# Altium project LimeSDR-X3_1v0.PrjPcb (part 8 of 19)

## Sheet 16_LMS2_RF2_Misc.SchDoc: LMS2 RF2 Misc
size A3; Organization: Lime Microsystems; Address1: Surrey Tech Centre; Address2: Guildford GU2 7YG; Address3: Surrey; Address4: United Kingdom; Revision: v1.0; SheetNumber: 16; SheetTotal: 31
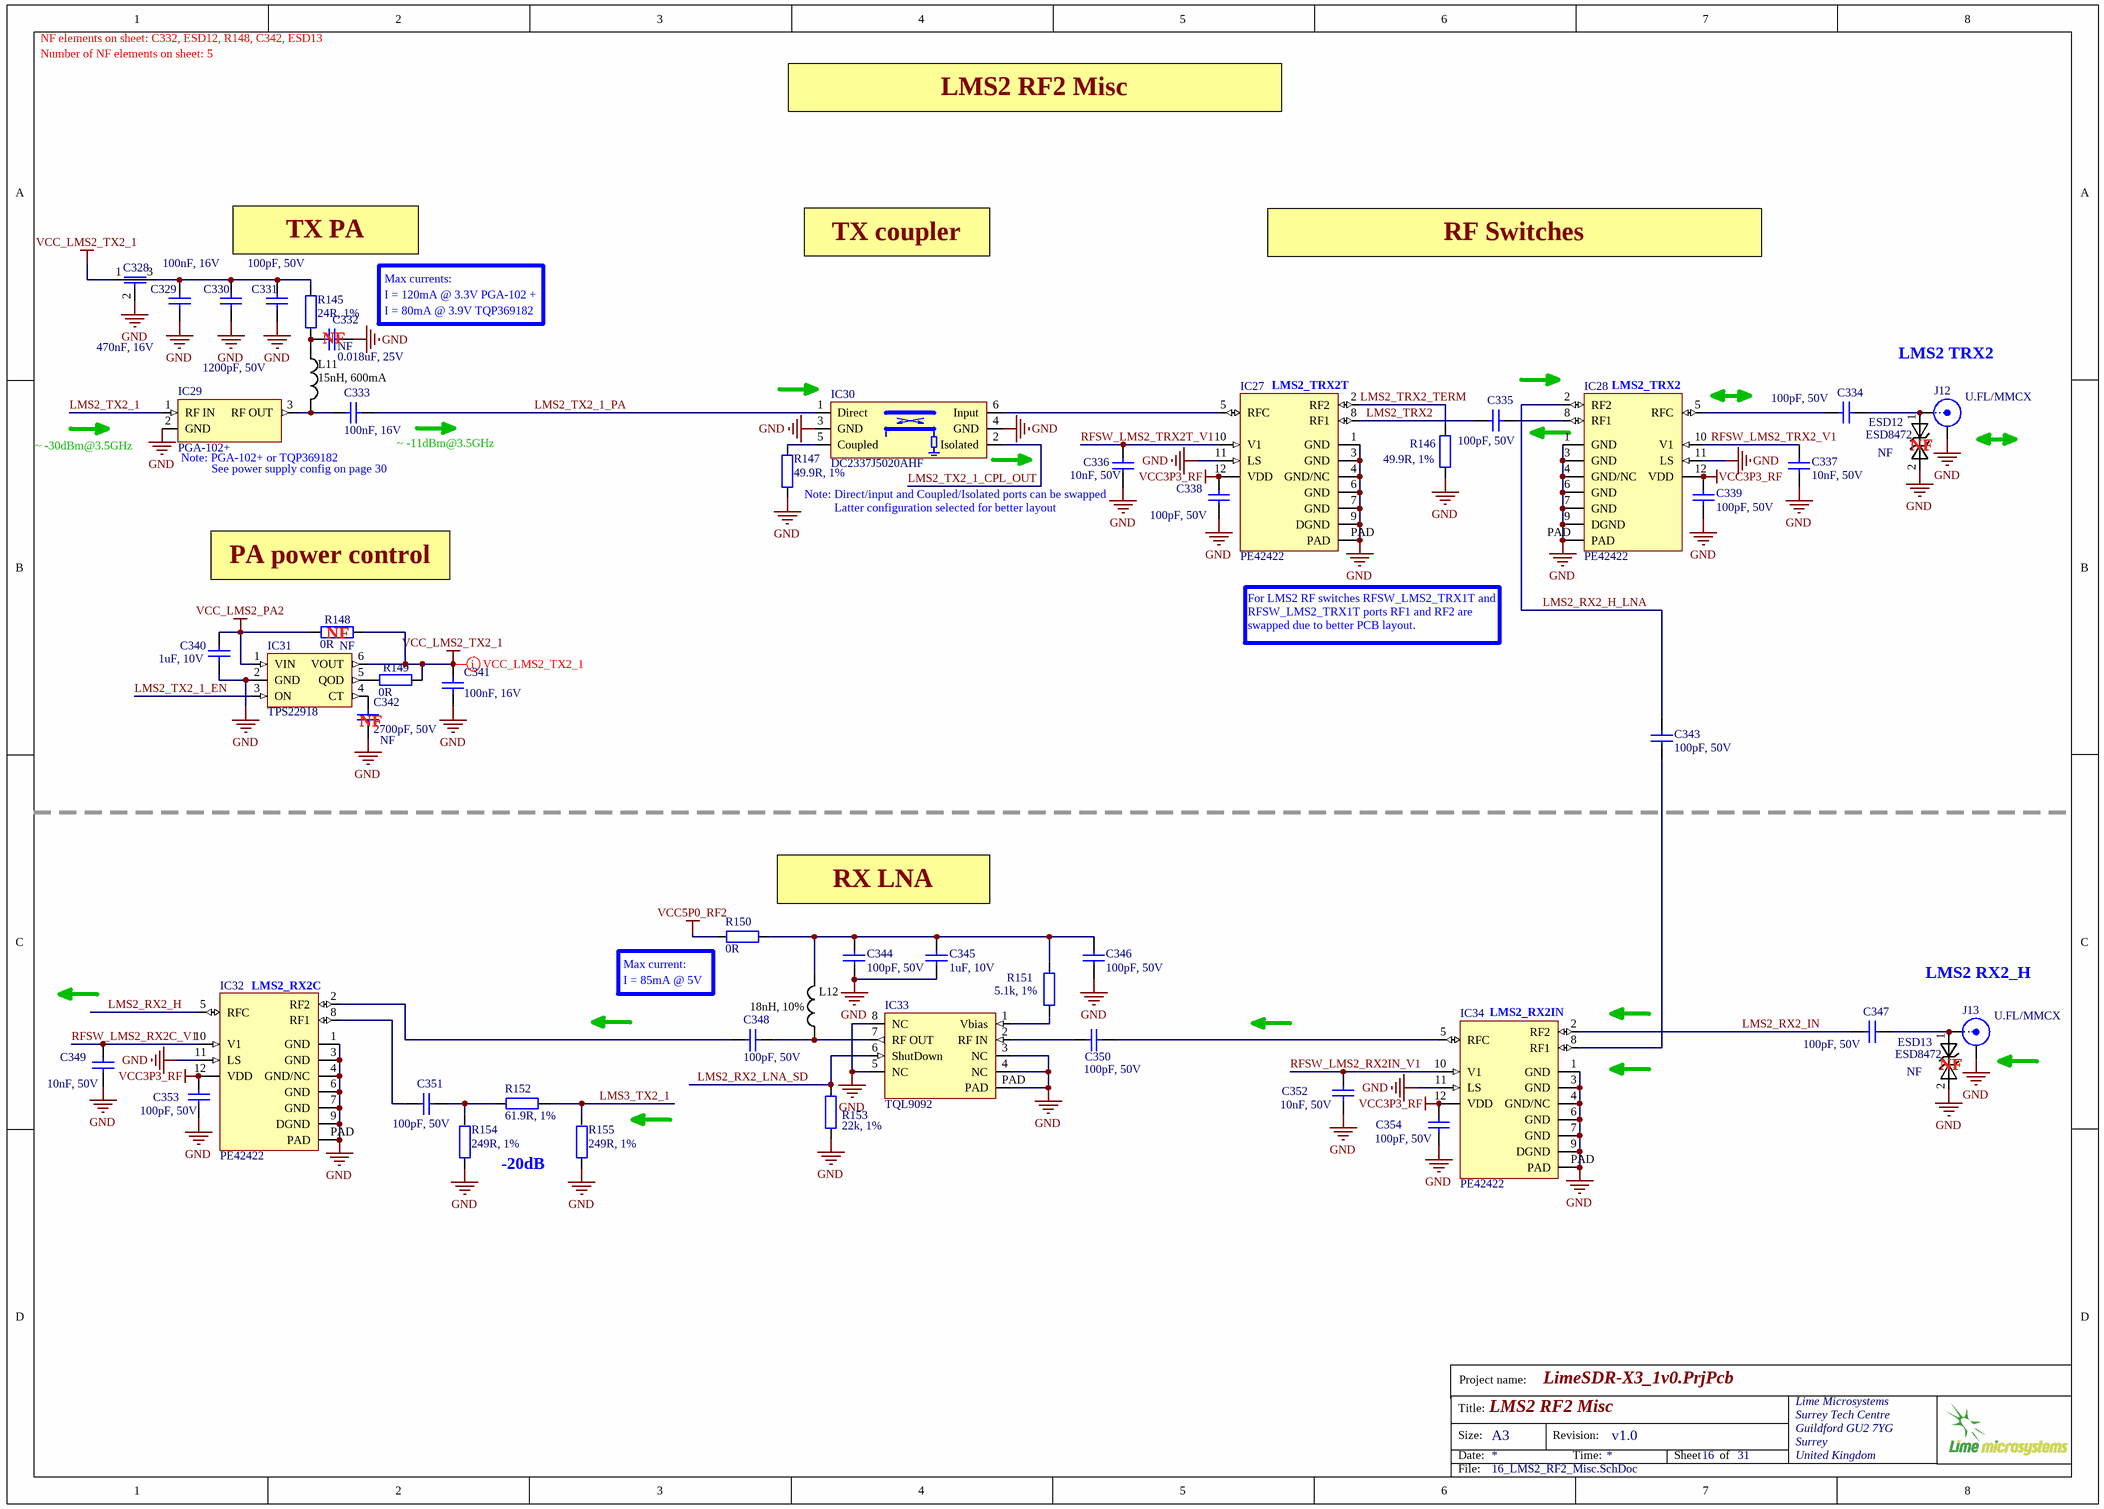
[diagram p15: 16_LMS2_RF2_Misc.SchDoc]

### Parts
C328  470nF, 16V  [CAP0805_FEEDTHROUGH]
C329  100nF, 16V  [CAP0402]
C330  1200pF, 50V  [CAP0402]
C331  100pF, 50V  [CAP0402]
C332  0.018uF, 25V  Assembly Info: NF  [CAP0402]
C333  100nF, 16V  [CAP0402]
C334  100pF, 50V  [CAP0402]
C335  100pF, 50V  [CAP0402]
C336  10nF, 50V  [CAP0402]
C337  10nF, 50V  [CAP0402]
C338  100pF, 50V  [CAP0402]
C339  100pF, 50V  [CAP0402]
C340  1uF, 10V  [CAP0402]
C341  100nF, 16V  [CAP0402]
C342  2700pF, 50V  Assembly Info: NF  [CAP0402]
C343  100pF, 50V  [CAP0402]
C344  100pF, 50V  [CAP0402]
C345  1uF, 10V  [CAP0402]
C346  100pF, 50V  [CAP0402]
C347  100pF, 50V  [CAP0402]
C348  100pF, 50V  [CAP0402]
C349  10nF, 50V  [CAP0402]
C350  100pF, 50V  [CAP0402]
C351  100pF, 50V  [CAP0402]
C352  10nF, 50V  [CAP0402]
C353  100pF, 50V  [CAP0402]
C354  100pF, 50V  [CAP0402]
ESD12  ESD8472  Assembly Info: NF  [ESD8472_X3DFN2]
ESD13  ESD8472  Assembly Info: NF  [ESD8472_X3DFN2]
IC27  PE42422  [PE42422_QFN12]
IC28  PE42422  [PE42422_QFN12]
IC29  PGA-102+  [PGA-102+_SOT89]
IC30  DC2337J5020AHF  [DC2337J5020AHF_ANAREN_COUPLER_0805]
IC31  TPS22918  [SOT23-6]
IC32  PE42422  [PE42422_QFN12]
IC33  TQL9092  [TQL9092]
IC34  PE42422  [PE42422_QFN12]
J12  U.FL/MMCX  [MMCX_UFL_conn_m]
J13  U.FL/MMCX  [MMCX_UFL_conn_m]
L11  15nH, 600mA  [RES0805]
L12  18nH, 10%  [RES0603]
R145  24R, 1%  [RES0402]
R146  49.9R, 1%  [RES0402]
R147  49.9R, 1%  [RES0402]
R148  0R  Assembly Info: NF  [RES0402]
R149  0R  [RES0402]
R150  0R  [RES0402]
R151  5.1k, 1%  [RES0603]
R152  61.9R, 1%  [RES0402]
R153  22k, 1%  [RES0402]
R154  249R, 1%  [RES0402]
R155  249R, 1%  [RES0402]

### Nets
GND: C328.2 C329.1 C330.2 C331.2 C332.2 C336.2 C337.2 C338.1 C339.1 C340.1 C341.1 C342.2 C344.2 C345.1 C346.2 C349.2 C352.2 C353.1 C354.1 ESD12.2 ESD13.2 IC27.1(GND) IC27.3(GND) IC27.4(GND/NC) IC27.6(GND) IC27.7(GND) IC27.9(DGND) IC27.11(LS) IC27.PAD IC28.1(GND) IC28.3(GND) IC28.4(GND/NC) IC28.6(GND) IC28.7(GND) IC28.9(DGND) IC28.11(LS) IC28.PAD IC29.2(GND) IC30.3(GND) IC30.4(GND) IC31.2(GND) IC32.1(GND) IC32.3(GND) IC32.4(GND/NC) IC32.6(GND) IC32.7(GND) IC32.9(DGND) IC32.11(LS) IC32.PAD IC33.3(NC) IC33.4(NC) IC33.5(NC) IC33.8(NC) IC33.PAD IC34.1(GND) IC34.3(GND) IC34.4(GND/NC) IC34.6(GND) IC34.7(GND) IC34.9(DGND) IC34.11(LS) IC34.PAD J12.2(Y) J13.2(Y) R146.2 R147.2 R153.1 R154.1 R155.1
VCC3P3_RF: C338.2 C339.2 C353.2 C354.2 IC27.12(VDD) IC28.12(VDD) IC32.12(VDD) IC34.12(VDD)
VCC5P0_RF2: R150.1
VCC_LMS2_PA2: C340.2 IC31.1(VIN) R148.2
VCC_LMS2_TX2_1: C328.1 C341.2 IC31.6(VOUT) R148.1 R149.1
LMS2_RX2_H: IC32.5(RFC)
LMS2_RX2_H_LNA: C343.2 IC28.2(RF2)
LMS2_RX2_IN: C347.1 IC34.2(RF2)
LMS2_RX2_LNA_SD: IC33.6(ShutDown) R153.2
LMS2_TRX2: C335.1 IC27.8(RF1)
LMS2_TRX2_TERM: IC27.2(RF2) R146.1
LMS2_TX2_1: IC29.1(RF_IN)
LMS2_TX2_1_CPL_OUT: IC30.2(Isolated)
LMS2_TX2_1_EN: IC31.3(ON)
LMS2_TX2_1_PA: C333.1 IC30.1(Direct)
LMS3_TX2_1: R152.2 R155.2
RFSW_LMS2_RX2C_V1: C349.1 IC32.10(V1)
RFSW_LMS2_RX2IN_V1: C352.1 IC34.10(V1)
RFSW_LMS2_TRX2_V1: C337.1 IC28.10(V1)
RFSW_LMS2_TRX2T_V1: C336.1 IC27.10(V1)
NetC328_3: C328.3 C329.2 C330.1 C331.1 R145.1
NetC332_1: C332.1 L11.1 R145.2
NetC333_2: C333.2 IC29.3(RF_OUT) L11.2
NetC334_1: C334.1 IC28.5(RFC)
NetC334_2: C334.2 ESD12.1 J12.1(X)
NetC335_2: C335.2 IC28.8(RF1)
NetC342_1: C342.1 IC31.4(CT)
NetC343_1: C343.1 IC34.8(RF1)
NetC344_1: C344.1 C345.2 C346.1 L12.1 R150.2 R151.2
NetC347_2: C347.2 ESD13.1 J13.1(X)
NetC348_1: C348.1 IC32.2(RF2)
NetC348_2: C348.2 IC33.7(RF_OUT) L12.2
NetC350_1: C350.1 IC33.2(RF_IN)
NetC350_2: C350.2 IC34.5(RFC)
NetC351_1: C351.1 R152.1 R154.2
NetC351_2: C351.2 IC32.8(RF1)
NetIC27_5: IC27.5(RFC) IC30.6(Input)
NetIC30_5: IC30.5(Coupled) R147.1
NetIC31_5: IC31.5(QOD) R149.2
NetIC33_1: IC33.1(Vbias) R151.1

### Layout directives
net class VCC_LMS2_TX2_2: VCC_LMS2_TX2_1

### Notes on the sheet
- NF elements on sheet: C332, ESD12, R148, C342, ESD13
- Number of NF elements on sheet: 5
- LMS2 RF2 Misc
- TX PA
- (near C328) Ch2
- I = 120mA @ 3.3V PGA-102 +
- Max currents:
- I = 80mA @ 3.9V TQP369182
- TX coupler
- RF Switches
- NF
- LMS2 TRX2
- (near IC29) ~ -30dBm@3.5GHz
- (near C333) ~ -11dBm@3.5GHz
- (near IC27) LMS2_TRX2T
- (near IC28) LMS2_TRX2
- (near ESD12) NF
- (near IC29) Note: PGA-102+ or TQP369182
- See power supply config on page 30
- Note: Direct/input and Coupled/Isolated ports can be swapped
- (near C336) Latter configuration selected for better layout
- PA power control
- (near R148) NF
- (near IC27) For LMS2 RF switches RFSW_LMS2_TRX1T and RFSW_LMS2_TRX1T ports RF1 and RF2 are swapped due to better PCB layout.
- (near C342) NF
- RX LNA
- (near IC32) LMS2_RX2C
- I = 85mA @ 5V
- (near R150) Max current:
- LMS2 RX2_H
- (near IC34) LMS2_RX2IN
- (near ESD13) NF
- -20dB
- Project name:
- Title:
- Size:
- Date:
- A3
- Revision:
- Time:
- Sheet
- of
- File:

### Library data of the parts
C328 = Cap_feed_through: as C271 on sheet 14_LMS1_RF_PA; Value: 470nF, 16V; Supplier 1: Digi-Key; Supplier Part Number 1: 490-2537-1-ND; Stock 1: 220606; Pricing 1: 1=0,25000, 10=0,22900, 25=0,21840, 50=0,21160, 100=0,20450, 250=0,19392, 500=0,16218, 1000=0,12586 (USD); Mount: Surface Mount,PCB; Case/Package: 0805; Weight: 0.000194oz; Case Code (Metric): 2012; Case Code (Imperial): 0805; Min Operating Temperature: -55°C; Max Operating Temperature: 125°C; Package Quantity: 1; Capacitance: 470nF; Packaging: Tape and Reel; Max Voltage Rating (DC): 16V; Current Rating: 2A; Voltage Rating: 16V; Voltage Rating (DC): 16V; Voltage: 16V; Current: 2A; Termination: Flat; Length: 2mm; Height: 0.85mm; Width: 1.25mm; Depth: 1.25mm; Radiation Hardening: No; REACH SVHC: No SVHC; Lead Free: Lead Free; RoHS: Yes
C329 C333 C341 = Cap_0402: as C262 on sheet 14_LMS1_RF_PA; Value: 100nF, 16V; Supplier 1: Mouser; Supplier Part Number 1: 81-GRM155R71C104KA88; Case Code - in: 0402; RoHS: RoHS Compliant; Operating Temperature Range: - 55 C to + 125 C; Series: GRM; Termination Style: SMD/SMT; Package / Case: 0402 (1005 metric); Voltage Rating DC: 16 V; Maximum Operating Temperature: + 125 C; Case Code - mm: 1005; Minimum Operating Temperature: - 55 C; Product Category: Low & Medium Capacitance SMD Ceramic Chip Capacitors; Packaging: Reel; Product: General Type MLCCs; Category: Multilayer Ceramic Capacitors MLCC - SMD/SMT; Brand: Murata Electronics; Case Width: 0.5 mm; RoHS - Mouser: Y; Standard Pack Qty: 10000; Minimum Order Quantity: 1; Reeling: True
C330 = Cap_0402: as C302 on sheet 15_LMS2_RF1_Misc; Value: 1200pF, 50V; Supplier 1: Digi-Key; Supplier Part Number 1: 399-7334-1-ND; Thickness (Max): 0.022" (0.55mm); Capacitance: 1200pF; Lead Spacing: -; Mounting Type: Surface Mount, MLCC; Package / Case: 0402 (1005 Metric); Category: Capacitors; Size / Dimension: 0.039" L x 0.020" W (1.00mm x 0.50mm); Voltage - Rated: 50V; Lead Style: -; Ratings: -; Features: -; Packaging: Cut Tape (CT); RoHS: RoHS Compliant; Operating Temperature: -55°C ~ 125°C; Applications: General Purpose; Height - Seated (Max): -
C331 C334 C335 C338 C339 C343 C344 C346-C348 C350 C351 C353 C354 = Cap_0402: as C264 on sheet 14_LMS1_RF_PA; Value: 100pF, 50V; Capacitance: 100pF; Thickness (Max): 0.022" (0.55mm); Size / Dimension: 0.039" L x 0.020" W (1.00mm x 0.50mm); RoHS: RoHS Compliant; Ratings: -; Package / Case: 0402 (1005 Metric); Mounting Type: Surface Mount, MLCC; Height - Seated (Max): -; Features: -; Lead Spacing: -; Voltage - Rated: 50V; Operating Temperature: -55°C ~ 125°C; Packaging: Cut Tape (CT); Applications: General Purpose; Lead Style: -; Supplier 1: Digi-Key; Category: Capacitors; Supplier Part Number 1: 311-1024-1-ND
C332 = Cap_0402: as C305 on sheet 15_LMS2_RF1_Misc; Value: 0.018uF, 25V; ComponentLink1URL: http://www.murata.com/~/media/webrenewal/support/library/catalog/products/capacitor/mlcc/c02e.ashx?la=en-us; ComponentLink1Description: http://www.murata.com/~/media/webrenewal/support/library/catalog/products/capacitor/mlcc/c02e.ashx?la=en-us; Supplier 1: Digi-Key; Supplier Part Number 1: 311-3345-1-ND; Stock 1: 39602; Pricing 1: 1=0,10000, 10=0,05000, 100=0,02210, 500=0,01580, 1000=0,01242, 2500=0,01129, 5000=0,01038 (USD); RoHS: Yes; Mount: Surface Mount; Case/Package: 0402; Min Operating Temperature: -55°C; Max Operating Temperature: 125°C; Packaging: Tape and Reel; Voltage Rating: 25V; Voltage Rating (DC): 25V; Length: 0.039inch; Width: 0.02inch; Thickness: 0.022inch; Lead Free: Lead Free; Halogen Free: Halogen Free; ComponentLink2URL: http://www.yageo.com/documents/recent/UPY-GPHC_X7R_6.3V-to-50V_18.pdf?src-supplier=Digi-Key; ComponentLink2Description: http://www.yageo.com/documents/recent/UPY-GPHC_X7R_6.3V-to-50V_18.pdf?src-supplier=Digi-Key; ComponentLink3URL: http://www.yageo.com/documents/recent/UPY-GPHC_X7R_6.3V-to-50V_16.pdf?src-supplier=Digi-Key; ComponentLink3Description: http://www.yageo.com/documents/recent/UPY-GPHC_X7R_6.3V-to-50V_16.pdf?src-supplier=Digi-Key
C336 C337 C349 C352 = Cap_0402: as C259 on sheet 14_LMS1_RF_PA; Value: 10nF, 50V; Supplier 1: Digi-Key; Supplier Part Number 1: 490-4516-2-ND; RoHS: RoHS Compliant; Category: Capacitors; Stock 1: 10970000; Pricing 1: 10000=0.00185, 20000=0.00176, 30000=0.00167 (USD); Packaging: Tape & Reel (TR); Part Status: Active; Voltage - Rated: 50V; Operating Temperature: -55°C ~ 125°C; Features: -; Ratings: -; Applications: General Purpose; Mounting Type: Surface Mount, MLCC; Package / Case: 0402 (1005 Metric); Size / Dimension: 0.039" L x 0.020" W (1.00mm x 0.50mm); Height - Seated (Max): -; Thickness (Max): 0.022" (0.55mm); Lead Spacing: -; Lead Style: -; ComponentLink1URL: http://www.murata.com/~/media/webrenewal/support/library/catalog/products/capacitor/mlcc/c02e.ashx?la=en-us; ComponentLink1Description: http://www.murata.com/~/media/webrenewal/support/library/catalog/products/capacitor/mlcc/c02e.ashx?la=en-us
C340 C345 = Cap_0402: as C261 on sheet 14_LMS1_RF_PA; Value: 1uF, 10V; Supplier 1: Digi-Key; Supplier Part Number 1: 445-9066-1-ND; MSL: -; RoHS: YES
C342 = Cap_0402: as C265 on sheet 14_LMS1_RF_PA; Value: 2700pF, 50V; Size / Dimension: 0.039" L x 0.020" W (1.00mm x 0.50mm); Supplier 1: Digi-Key; Height - Seated (Max): -; Package / Case: 0402 (1005 Metric); Supplier Part Number 1: 490-6361-1-ND; Part Status: Active; RoHS: RoHS Compliant; Operating Temperature: -55°C ~ 125°C; Category: Capacitors; Ratings: -; Features: -; Packaging: Cut Tape (CT); Mounting Type: Surface Mount, MLCC; Voltage - Rated: 50V; Lead Spacing: -; Thickness (Max): 0.022" (0.55mm); Applications: General Purpose
ESD12 ESD13 = ESD8472: as ESD8 on sheet 14_LMS1_RF_PA; Supplier 1: Digi-Key; RoHS: RoHS Compliant; Category: Circuit Protection; Stock 1: 2295; Pricing 1: 1=0.39, 10=0.315, 100=0.2142, 500=0.16068, 1000=0.12051 (USD); Packaging: Cut Tape (CT); Part Status: Active; Type: Zener; Power - Peak Pulse: -; Applications: Automotive, RF Antenna; Operating Temperature: -55°C ~ 150°C (TJ); Mounting Type: Surface Mount; Package / Case: 2-XFDFN; Supplier Device Package: 2-X3DFN (0.62x0.32); ComponentLink1URL: http://www.onsemi.com/pub/Collateral/ESD8472-D.PDF; ComponentLink1Description: http://www.onsemi.com/pub/Collateral/ESD8472-D.PDF; Supplier Part Number 1: ESD8472MUT5GOSCT-ND
IC27 IC28 IC32 IC34 = PE42422: as IC19 on sheet 15_LMS2_RF1_Misc; Supplier 1: Digi-Key; RoHS: RoHS Compliant; Category: RF/IF and RFID; Stock 1: 21993; Pricing 1: 1=1.32, 101=0.92 (USD); Packaging: Cut Tape (CT); Part Status: Active; P1dB: -; Features: -; Operating Temperature: -40°C ~ 85°C; Package / Case: 12-UFQFN Exposed Pad; Supplier Device Package: 12-QFN (2x2); ComponentLink1URL: http://www.psemi.com/pdf/datasheets/pe42422ds.pdf; ComponentLink1Description: http://www.psemi.com/pdf/datasheets/pe42422ds.pdf; Supplier Part Number 1: 1046-1062-1-ND
IC29 = PGA-102+_PA: as IC21 on sheet 15_LMS2_RF1_Misc; Supplier Part Number 1: 772-TQP369182; Supplier 1: Mouser
IC30 = DC2337J5020AHF_coupler: as IC22 on sheet 15_LMS2_RF1_Misc; Supplier Part Number 1: 1173-1090-2-ND; Manufacturer Part Number 1: DC2337J5020AHF; Supplier 1: Digi-Key
IC31 = TPS22918: as IC13 on sheet 14_LMS1_RF_PA; Supplier 1: Digi-Key; RoHS: RoHS Compliant; Category: Integrated Circuits (ICs); Stock 1: 16592; Pricing 1: 1=0.63, 10=0.551, 100=0.4222 (USD); Packaging: Digi-Reel®; Part Status: Active; Features: Load Discharge, Slew Rate Controlled; Fault Protection: -; Operating Temperature: -40°C ~ 105°C (TA); Package / Case: SOT-23-6; Supplier Device Package: SOT-23-6; ComponentLink1URL: http://www.ti.com/lit/ds/symlink/tps22918.pdf; ComponentLink1Description: http://www.ti.com/lit/ds/symlink/tps22918.pdf; Supplier Part Number 1: 296-44073-6-ND
IC33 = TQL9092: as IC25 on sheet 15_LMS2_RF1_Misc; Manufacturer Part Number 1: TQL9092; Supplier 1: Mouser; Supplier Part Number 1: 772-TQL9092
J12 J13 = RF_IF_connector: as J8 on sheet 14_LMS1_RF_PA; Fastening Type: SNAP-ON; Housing Color: Black; Packaging: Tape and Reel; RoHS: Yes; Supplier 1: Digi-Key; Supplier Part Number 1: ARF1725CT-ND; Body Plating: Gold; Case/Package: 908; ComponentLink1Description: https://datasheet.ciiva.com/5177/c908-22101t-37976-5177328.pdf?src-supplier=Mouser; ComponentLink1URL: https://datasheet.ciiva.com/5177/c908-22101t-37976-5177328.pdf?src-supplier=Mouser; ComponentLink2Description: https://datasheet.ciiva.com/643/c908-22101t-643558.pdf?src-supplier=Digi-Key; ComponentLink2URL: https://datasheet.ciiva.com/643/c908-22101t-643558.pdf?src-supplier=Digi-Key; ComponentLink3Description: https://datasheet.ciiva.com/7662/1636995-7662651.pdf?src-supplier=Element14; ComponentLink3URL: https://datasheet.ciiva.com/7662/1636995-7662651.pdf?src-supplier=Element14; ComponentLink4Description: https://datasheet.ciiva.com/5689/c908-22101t-5689787.pdf?src-supplier=Farnell; ComponentLink4URL: https://datasheet.ciiva.com/5689/c908-22101t-5689787.pdf?src-supplier=Farnell; ComponentLink5Description: https://datasheet.ciiva.com/7996/691284-7996807.pdf?src-supplier=Element14; ComponentLink5URL: https://datasheet.ciiva.com/7996/691284-7996807.pdf?src-supplier=Element14; ComponentLink6Description: https://datasheet.ciiva.com/643/c908-22101t-643559.pdf?src-supplier=Digi-Key; ComponentLink6URL: https://datasheet.ciiva.com/643/c908-22101t-643559.pdf?src-supplier=Digi-Key; ComponentLink7Description: https://datasheet.ciiva.com/643/c908-22101t-643560.pdf?src-supplier=Digi-Key; ComponentLink7URL: https://datasheet.ciiva.com/643/c908-22101t-643560.pdf?src-supplier=Digi-Key; Contact Material: Copper; Contact Plating: Gold; Depth: 4.32mm; Insulation Material: Polymer; Length: 4.32mm; Max Frequency: 6GHz; Max Operating Temperature: 155°C; Min Operating Temperature: -40°C; Mount: Surface Mount,PCB; Orientation: Straight; Package Quantity: 1; Plating: Gold; Pricing 1: 1=6,18000, 10=5,60700, 25=5,31040, 50=5,18700, 100=4,94000, 250=4,32248, 500=4,19900 (USD); Radiation Hardening: No; REACH SVHC: Unknown; Series: MicroMate™; Stock 1: 6928; Termination: Solder
L11 = Inductor_0603: as L9 on sheet 15_LMS2_RF1_Misc; Value: 15nH, 600mA; Supplier 1: Digi-Key; Supplier Part Number 1: CW201212-15NJDKR-ND; Stock 1: 2733; Pricing 1: 1=0.37, 10=0.327, 100=0.2245, 500=0.19188, 1000=0.14697 (USD); Mount: Surface Mount; Case/Package: 0805; Weight: 0.000194oz; Case Code (Metric): 2012; Case Code (Imperial): 0805; Min Operating Temperature: -40°C; Max Operating Temperature: 125°C; Package Quantity: 2000; Packaging: Tape and Reel; Current Rating: 600mA; Inductance: 15nH; Max DC Current: 600mA; Termination: SMD/SMT; Composition: Wirewound,Ceramic; DC Current: 600mA; Military Standard: Not; Length: 0.083inch; Height: 0.051inch; Width: 1.5mm; Height - Seated (Max): 0.059inch; Depth: 1.7mm; Radiation Hardening: No; ComponentLink1URL: http://www.bourns.com/data/global/PDFs/CW201212.pdf?src-supplier=Avnet+Europe; ComponentLink1Description: http://www.bourns.com/data/global/PDFs/CW201212.pdf?src-supplier=Avnet+Europe; ComponentLink2URL: http://www.bourns.com/data/global/pdfs/CW201212.pdf?src-supplier=Digi-Key; ComponentLink2Description: http://www.bourns.com/data/global/pdfs/CW201212.pdf?src-supplier=Digi-Key; ComponentLink3URL: http://www.bourns.com/data/global/PDFs/CW201212.pdf?src-supplier=Avnet; ComponentLink3Description: http://www.bourns.com/data/global/PDFs/CW201212.pdf?src-supplier=Avnet; ComponentLink4URL: http://www.onlinecomponents.com/productFiles/mf-BO/cw201212.pdf?src-supplier=Onlinecomponents.com; ComponentLink4Description: http://www.onlinecomponents.com/productFiles/mf-BO/cw201212.pdf?src-supplier=Onlinecomponents.com
L12 = Inductor: as L1 on sheet 14_LMS1_RF_PA; Value: 18nH, 10%; Supplier 1: Digi-Key; Supplier Part Number 1: 1840-1105-1-ND; RoHS: RoHS Compliant; Category: Inductors, Coils, Chokes; Stock 1: 14000; Pricing 1: 1=0.41, 10=0.368, 100=0.253, 500=0.2162, 1000=0.1656 (USD); Packaging: Cut Tape (CT); Part Status: Active; Tolerance: ±10%; Ratings: -; Operating Temperature: -40°C ~ 125°C; Mounting Type: Surface Mount; Package / Case: 0603 (1608 Metric); Supplier Device Package: 0603 (1608 Metric); Size / Dimension: 0.071" L x 0.049" W (1.80mm x 1.24mm); Height - Seated (Max): 0.040" (1.02mm); ComponentLink1URL: http://productfinder.pulseeng.com/products/datasheets/WC701.pdf; ComponentLink1Description: http://productfinder.pulseeng.com/products/datasheets/WC701.pdf
R145 = Res_0402: as R111 on sheet 14_LMS1_RF_PA; Value: 24R, 1%; Supplier 1: Digi-Key; Supplier Part Number 1: 13-AC0402FR-0724RLCT-ND; Stock 1: 14420; Pricing 1: 1=0.1, 10=0.022, 100=0.009, 1000=0.00402, 2500=0.00349, 5000=0.00288 (USD); Case/Package: 0402; Min Operating Temperature: -55°C; Max Operating Temperature: 155°C; Packaging: Tape and Reel; Resistance: 24R; Resistor Type: Thick Film; Number of Terminations: 2; Tolerance: 1%; Features: Moisture Resistant,Automotive AEC-Q200; Length: 0.039inch; Width: 0.02inch; Height: 0.015inch; RoHS Compliant: Yes; ComponentLink1URL: http://www.yageo.com/NewPortal/yageodocoutput?fileName=/pdf/R-Chip/PYu-AC_51_RoHS_L_6.pdf&src-supplier=Digi-Key; ComponentLink1Description: http://www.yageo.com/NewPortal/yageodocoutput?fileName=/pdf/R-Chip/PYu-AC_51_RoHS_L_6.pdf&src-supplier=Digi-Key
R146 R147 = Res_0402: as R135 on sheet 15_LMS2_RF1_Misc; Number of Terminations: 2; Size / Dimension: 0.039" L x 0.020" W (1.00mm x 0.50mm); Supplier Device Package: 0402 (1005 Metric); RoHS: RoHS Compliant; Supplier Part Number 1: 1276-3469-6-ND; Features: -; Packaging: Digi-Reel®; Tolerance: ±1%; Height: 0.016" (0.40mm); Category: Resistors; Composition: Thick Film; Package / Case: 0402 (1005 Metric); Supplier 1: Digi-Key; Operating Temperature: -55°C ~ 155°C; Value: 49.9R, 1%; Manufacturer Part Number 1: RC1005F49R9CS
R148-R150 = Res_0402: as R110 on sheet 14_LMS1_RF_PA; Value: 0R; Supplier 1: Digi-Key; Supplier Part Number 1: 311-0.0JRTR-ND; Category: Resistors; Temperature Coefficient: -; Features: Moisture Resistant; Supplier Device Package: 0402; Height: 0.016" (0.40mm); Package / Case: 0402 (1005 Metric); Operating Temperature: -55°C ~ 155°C; Size / Dimension: 0.039" L x 0.020" W (1.00mm x 0.50mm); Composition: Thick Film; Packaging: Tape & Reel (TR); Number of Terminations: 2; RoHS: RoHS Compliant
R151 = Res_0603: as R140 on sheet 15_LMS2_RF1_Misc; Value: 5.1k, 1%; ComponentLink1URL: https://industrial.panasonic.com/cdbs/www-data/pdf/RDA0000/AOA0000C304.pdf; ComponentLink1Description: https://industrial.panasonic.com/cdbs/www-data/pdf/RDA0000/AOA0000C304.pdf; Supplier 1: Digi-Key; Supplier Part Number 1: RMCF0603FT5K10CT-ND; Stock 1: 1507174; Pricing 1: 1=0,10000, 10=0,01500, 100=0,00610, 1000=0,00273, 2500=0,00237 (USD); RoHS: Yes; Mount: Surface Mount; Case/Package: 0603; Case Code (Metric): 1608; Case Code (Imperial): 0603; Contact Plating: Tin,Matte; Min Operating Temperature: -55°C; Max Operating Temperature: 155°C; Tolerance: 1%; Packaging: Tape and Reel; Resistor Type: Thick Film; Number of Terminations: 2; Features: Automotive AEC-Q200; Series: RMCF; Length: 0.061inch; Width: 0.031inch; Height: 0.022inch; Radiation Hardening: No; RoHS Compliant: Yes; ComponentLink2URL: http://components.arrow.com/part/dataview/50863347S9465827N1174?src-supplier=Arrow+Electronics; ComponentLink2Description: http://components.arrow.com/part/dataview/50863347S9465827N1174?src-supplier=Arrow+Electronics; ComponentLink3URL: https://www.seielect.com/catalog/SEI-RMCF_RMCP.pdf?src-supplier=Avnet; ComponentLink3Description: https://www.seielect.com/catalog/SEI-RMCF_RMCP.pdf?src-supplier=Avnet; ComponentLink4URL: https://www.seielect.com/catalog/SEI-Packaging.pdf?src-supplier=Digi-Key; ComponentLink4Description: https://www.seielect.com/catalog/SEI-Packaging.pdf?src-supplier=Digi-Key
R152 = Res_0402: Part Description: 61.9 Ohms ±1% 0.063W, 1/16W Chip Resistor 0402 (1005 Metric) Moisture Resistant Thick Film; Manufacturer: Yageo; Manufacturer Part Number 1: RC0402FR-0761R9L; Power Rating: 62.5mW; Voltage Rating: 50V; Temperature Coefficient: 100ppm/°C; Max Power Dissipation: 63mW; Value: 61.9R, 1%; ComponentLink1URL: https://datasheet.ciiva.com/12577/pyu-rc0402-51-rohs-l-6-r-12577388.pdf?src-supplier=Mouser; ComponentLink1Description: https://datasheet.ciiva.com/12577/pyu-rc0402-51-rohs-l-6-r-12577388.pdf?src-supplier=Mouser; ComponentLink2URL: https://datasheet.ciiva.com/17332/pyu-rc0402-51-rohs-l-6-17332587.pdf?src-supplier=Future+Electronics; ComponentLink2Description: https://datasheet.ciiva.com/17332/pyu-rc0402-51-rohs-l-6-17332587.pdf?src-supplier=Future+Electronics; Supplier 1: Digi-Key; Supplier Part Number 1: 311-61.9LRCT-ND; Stock 1: 93771; Pricing 1: 1=0,10000, 10=0,01600, 100=0,00660, 1000=0,00299, 2500=0,00259, 5000=0,00214 (USD); RoHS: Yes; Case/Package: 0402; Case Code (Imperial): 0402; Case Code (Metric): 1005; Contact Plating: Tin,Matte,Lead; Min Operating Temperature: -55°C; Max Operating Temperature: 155°C; Package Quantity: 1; Resistance: 61.9R; Tolerance: 1%; Packaging: Tape and Reel; Termination: SMD/SMT; Resistor Type: Thick Film; Number of Terminations: 2; Voltage Rating (DC): 50V; Working Voltage: 50V; Features: Moisture Resistant; Series: RC; Construction: Rectangular; Technology: THICK FILM; Length: 1mm; Width: 0.5mm; Height: 0.016inch; Depth: 0.5mm; Radiation Hardening: No; Military Standard: Not; Lead Free: Lead Free; RoHS Compliant: Yes; ComponentLink3URL: https://datasheet.ciiva.com/2453/pyu-r-int-thick-7-2453707.pdf?src-supplier=Digi-Key; ComponentLink3Description: https://datasheet.ciiva.com/2453/pyu-r-int-thick-7-2453707.pdf?src-supplier=Digi-Key; ComponentLink4URL: https://datasheet.ciiva.com/2453/pyu-r-int-thick-7-2453708.pdf?src-supplier=Digi-Key; ComponentLink4Description: https://datasheet.ciiva.com/2453/pyu-r-int-thick-7-2453708.pdf?src-supplier=Digi-Key; ComponentLink5URL: https://datasheet.ciiva.com/2453/pyu-r-int-thick-7-2453706.pdf?src-supplier=Digi-Key; ComponentLink5Description: https://datasheet.ciiva.com/2453/pyu-r-int-thick-7-2453706.pdf?src-supplier=Digi-Key; ComponentLink6URL: https://datasheet.ciiva.com/8888/pyu-rc0402-51-rohs-l-6-8888591.pdf?src-supplier=Avnet; ComponentLink6Description: https://datasheet.ciiva.com/8888/pyu-rc0402-51-rohs-l-6-8888591.pdf?src-supplier=Avnet; ComponentLink7URL: https://datasheet.ciiva.com/16741/pyu-rc0402-51-rohs-l-6-r-16741941.pdf?src-supplier=Future+Electronics; ComponentLink7Description: https://datasheet.ciiva.com/16741/pyu-rc0402-51-rohs-l-6-r-16741941.pdf?src-supplier=Future+Electronics; ComponentLink8URL: https://datasheet.ciiva.com/15189/getdatasheetpartid-325045-15189495.pdf?src-supplier=Verical; ComponentLink8Description: https://datasheet.ciiva.com/15189/getdatasheetpartid-325045-15189495.pdf?src-supplier=Verical
R153 = Res_0402: as R142 on sheet 15_LMS2_RF1_Misc; Value: 22k, 1%; Number of Terminations: 2; Operating Temperature: -55°C ~ 155°C; Package / Case: 0402 (1005 Metric); Category: Resistors; Size / Dimension: 0.039" L x 0.020" W (1.00mm x 0.50mm); Height: 0.016" (0.40mm); Supplier 1: Digi-Key; Supplier Part Number 1: 311-22.0KLRCT-ND; RoHS: RoHS Compliant; Features: Moisture Resistant; Packaging: Cut Tape (CT); Composition: Thick Film; Supplier Device Package: 0402; Resistance (Ohms): 22k; Tolerance: ±1%
R154 R155 = Res_0402: as R143 on sheet 15_LMS2_RF1_Misc; Value: 249R, 1%; Category: Resistors; Composition: Thick Film; Features: -; Height: 0.016" (0.40mm); Number of Terminations: 2; Operating Temperature: -55°C ~ 155°C; Package / Case: 0402 (1005 Metric); Packaging: Cut Tape (CT); RoHS: RoHS Compliant; Size / Dimension: 0.039" L x 0.020" W (1.00mm x 0.50mm); Supplier 1: Digi-Key; Supplier Device Package: 0402; Supplier Part Number 1: RMCF0402FT249RCT-ND; Tolerance: ±1%

## Sheet 17_FPGA_B12_B13_B14_B15.SchDoc: FPGA Banks 12, 13, 14, 15
size A3; Organization: Lime Microsystems; Address1: Surrey Tech Centre; Address2: Guildford GU2 7YG; Address3: Surrey; Address4: United Kingdom; Revision: v1.0; SheetNumber: 17; SheetTotal: 31
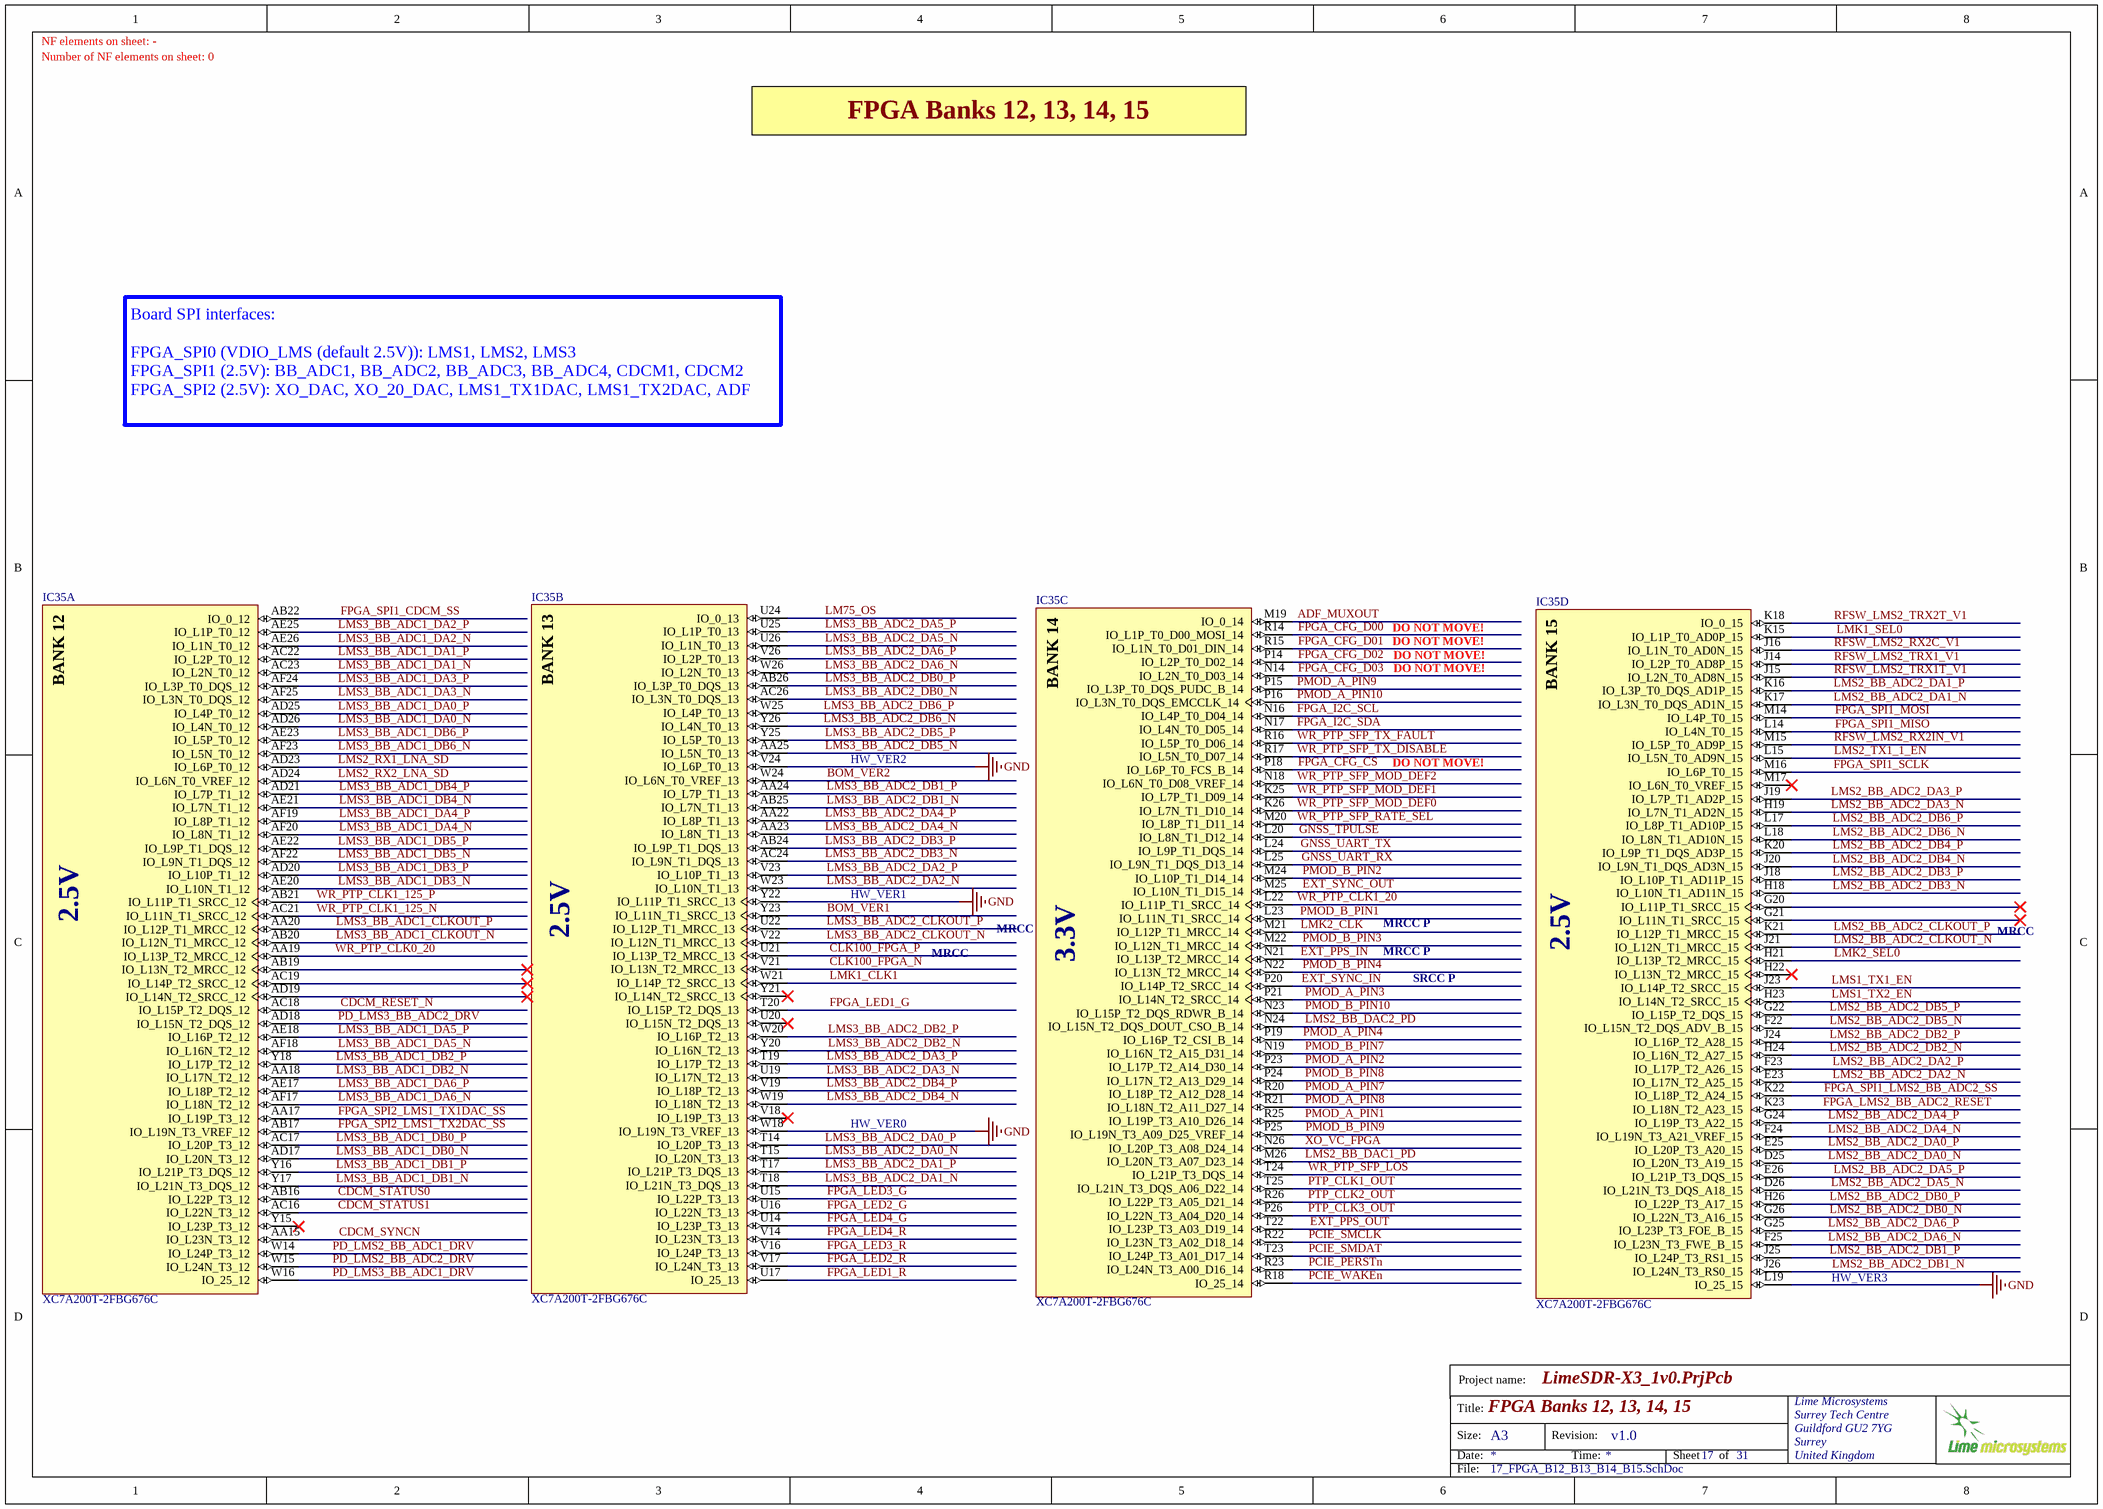
[diagram p16: 17_FPGA_B12_B13_B14_B15.SchDoc]

### Parts
IC35  XC7A200T-2FBG676C  [XC7A200T-2FBG676C_FBG676]  (parts A,B,C,D of 14)

### Nets
GND: IC35.L19(IO_25_15) IC35.V24(IO_L6P_T0_13) IC35.W18(IO_L19N_T3_VREF_13) IC35.Y22(IO_L11P_T1_SRCC_13)
ADF_MUXOUT: IC35.M19(IO_0_14)
BOM_VER1: IC35.Y23(IO_L11N_T1_SRCC_13)
BOM_VER2: IC35.W24(IO_L6N_T0_VREF_13)
CDCM_RESET_N: IC35.AC18(IO_L15P_T2_DQS_12)
CDCM_STATUS0: IC35.AB16(IO_L22P_T3_12)
CDCM_STATUS1: IC35.AC16(IO_L22N_T3_12)
CDCM_SYNCN: IC35.AA15(IO_L23N_T3_12)
CLK100_FPGA_N: IC35.V21(IO_L13N_T2_MRCC_13)
CLK100_FPGA_P: IC35.U21(IO_L13P_T2_MRCC_13)
EXT_PPS_IN: IC35.N21(IO_L13P_T2_MRCC_14)
EXT_PPS_OUT: IC35.T22(IO_L23P_T3_A03_D19_14)
EXT_SYNC_IN: IC35.P20(IO_L14P_T2_SRCC_14)
EXT_SYNC_OUT: IC35.M25(IO_L10N_T1_D15_14)
FPGA_CFG_CS: IC35.P18(IO_L6P_T0_FCS_B_14)
FPGA_CFG_D00: IC35.R14(IO_L1P_T0_D00_MOSI_14)
FPGA_CFG_D01: IC35.R15(IO_L1N_T0_D01_DIN_14)
FPGA_CFG_D02: IC35.P14(IO_L2P_T0_D02_14)
FPGA_CFG_D03: IC35.N14(IO_L2N_T0_D03_14)
FPGA_I2C_SCL: IC35.N16(IO_L4P_T0_D04_14)
FPGA_I2C_SDA: IC35.N17(IO_L4N_T0_D05_14)
FPGA_LED1_G: IC35.T20(IO_L15P_T2_DQS_13)
FPGA_LED1_R: IC35.U17(IO_25_13)
FPGA_LED2_G: IC35.U16(IO_L22N_T3_13)
FPGA_LED2_R: IC35.V17(IO_L24N_T3_13)
FPGA_LED3_G: IC35.U15(IO_L22P_T3_13)
FPGA_LED3_R: IC35.V16(IO_L24P_T3_13)
FPGA_LED4_G: IC35.U14(IO_L23P_T3_13)
FPGA_LED4_R: IC35.V14(IO_L23N_T3_13)
FPGA_LMS2_BB_ADC2_RESET: IC35.K23(IO_L18N_T2_A23_15)
FPGA_SPI1_CDCM_SS: IC35.AB22(IO_0_12)
FPGA_SPI1_LMS2_BB_ADC2_SS: IC35.K22(IO_L18P_T2_A24_15)
FPGA_SPI1_MISO: IC35.L14(IO_L4N_T0_15)
FPGA_SPI1_MOSI: IC35.M14(IO_L4P_T0_15)
FPGA_SPI1_SCLK: IC35.M16(IO_L6P_T0_15)
FPGA_SPI2_LMS1_TX1DAC_SS: IC35.AA17(IO_L19P_T3_12)
FPGA_SPI2_LMS1_TX2DAC_SS: IC35.AB17(IO_L19N_T3_VREF_12)
GNSS_TPULSE: IC35.L20(IO_L8N_T1_D12_14)
GNSS_UART_RX: IC35.L25(IO_L9N_T1_DQS_D13_14)
GNSS_UART_TX: IC35.L24(IO_L9P_T1_DQS_14)
LM75_OS: IC35.U24(IO_0_13)
LMK1_CLK1: IC35.W21(IO_L14P_T2_SRCC_13)
LMK1_SEL0: IC35.K15(IO_L1P_T0_AD0P_15)
LMK2_CLK: IC35.M21(IO_L12P_T1_MRCC_14)
LMK2_SEL0: IC35.H21(IO_L13P_T2_MRCC_15)
LMS1_TX1_EN: IC35.J23(IO_L14P_T2_SRCC_15)
LMS1_TX2_EN: IC35.H23(IO_L14N_T2_SRCC_15)
LMS2_BB_ADC2_CLKOUT_N: IC35.J21(IO_L12N_T1_MRCC_15)
LMS2_BB_ADC2_CLKOUT_P: IC35.K21(IO_L12P_T1_MRCC_15)
LMS2_BB_ADC2_DA0_N: IC35.D25(IO_L20N_T3_A19_15)
LMS2_BB_ADC2_DA0_P: IC35.E25(IO_L20P_T3_A20_15)
LMS2_BB_ADC2_DA1_N: IC35.K17(IO_L3N_T0_DQS_AD1N_15)
LMS2_BB_ADC2_DA1_P: IC35.K16(IO_L3P_T0_DQS_AD1P_15)
LMS2_BB_ADC2_DA2_N: IC35.E23(IO_L17N_T2_A25_15)
LMS2_BB_ADC2_DA2_P: IC35.F23(IO_L17P_T2_A26_15)
LMS2_BB_ADC2_DA3_N: IC35.H19(IO_L7N_T1_AD2N_15)
LMS2_BB_ADC2_DA3_P: IC35.J19(IO_L7P_T1_AD2P_15)
LMS2_BB_ADC2_DA4_N: IC35.F24(IO_L19N_T3_A21_VREF_15)
LMS2_BB_ADC2_DA4_P: IC35.G24(IO_L19P_T3_A22_15)
LMS2_BB_ADC2_DA5_N: IC35.D26(IO_L21N_T3_DQS_A18_15)
LMS2_BB_ADC2_DA5_P: IC35.E26(IO_L21P_T3_DQS_15)
LMS2_BB_ADC2_DA6_N: IC35.F25(IO_L23N_T3_FWE_B_15)
LMS2_BB_ADC2_DA6_P: IC35.G25(IO_L23P_T3_FOE_B_15)
LMS2_BB_ADC2_DB0_N: IC35.G26(IO_L22N_T3_A16_15)
LMS2_BB_ADC2_DB0_P: IC35.H26(IO_L22P_T3_A17_15)
LMS2_BB_ADC2_DB1_N: IC35.J26(IO_L24N_T3_RS0_15)
LMS2_BB_ADC2_DB1_P: IC35.J25(IO_L24P_T3_RS1_15)
LMS2_BB_ADC2_DB2_N: IC35.H24(IO_L16N_T2_A27_15)
LMS2_BB_ADC2_DB2_P: IC35.J24(IO_L16P_T2_A28_15)
LMS2_BB_ADC2_DB3_N: IC35.H18(IO_L10N_T1_AD11N_15)
LMS2_BB_ADC2_DB3_P: IC35.J18(IO_L10P_T1_AD11P_15)
LMS2_BB_ADC2_DB4_N: IC35.J20(IO_L9N_T1_DQS_AD3N_15)
LMS2_BB_ADC2_DB4_P: IC35.K20(IO_L9P_T1_DQS_AD3P_15)
LMS2_BB_ADC2_DB5_N: IC35.F22(IO_L15N_T2_DQS_ADV_B_15)
LMS2_BB_ADC2_DB5_P: IC35.G22(IO_L15P_T2_DQS_15)
LMS2_BB_ADC2_DB6_N: IC35.L18(IO_L8N_T1_AD10N_15)
LMS2_BB_ADC2_DB6_P: IC35.L17(IO_L8P_T1_AD10P_15)
LMS2_BB_DAC1_PD: IC35.M26(IO_L20N_T3_A07_D23_14)
LMS2_BB_DAC2_PD: IC35.N24(IO_L15N_T2_DQS_DOUT_CSO_B_14)
LMS2_RX1_LNA_SD: IC35.AD23(IO_L6P_T0_12)
LMS2_RX2_LNA_SD: IC35.AD24(IO_L6N_T0_VREF_12)
LMS2_TX1_1_EN: IC35.L15(IO_L5N_T0_AD9N_15)
LMS3_BB_ADC1_CLKOUT_N: IC35.AB20(IO_L12N_T1_MRCC_12)
LMS3_BB_ADC1_CLKOUT_P: IC35.AA20(IO_L12P_T1_MRCC_12)
LMS3_BB_ADC1_DA0_N: IC35.AD26(IO_L4N_T0_12)
LMS3_BB_ADC1_DA0_P: IC35.AD25(IO_L4P_T0_12)
LMS3_BB_ADC1_DA1_N: IC35.AC23(IO_L2N_T0_12)
LMS3_BB_ADC1_DA1_P: IC35.AC22(IO_L2P_T0_12)
LMS3_BB_ADC1_DA2_N: IC35.AE26(IO_L1N_T0_12)
LMS3_BB_ADC1_DA2_P: IC35.AE25(IO_L1P_T0_12)
LMS3_BB_ADC1_DA3_N: IC35.AF25(IO_L3N_T0_DQS_12)
LMS3_BB_ADC1_DA3_P: IC35.AF24(IO_L3P_T0_DQS_12)
LMS3_BB_ADC1_DA4_N: IC35.AF20(IO_L8N_T1_12)
LMS3_BB_ADC1_DA4_P: IC35.AF19(IO_L8P_T1_12)
LMS3_BB_ADC1_DA5_N: IC35.AF18(IO_L16N_T2_12)
LMS3_BB_ADC1_DA5_P: IC35.AE18(IO_L16P_T2_12)
LMS3_BB_ADC1_DA6_N: IC35.AF17(IO_L18N_T2_12)
LMS3_BB_ADC1_DA6_P: IC35.AE17(IO_L18P_T2_12)
LMS3_BB_ADC1_DB0_N: IC35.AD17(IO_L20N_T3_12)
LMS3_BB_ADC1_DB0_P: IC35.AC17(IO_L20P_T3_12)
LMS3_BB_ADC1_DB1_N: IC35.Y17(IO_L21N_T3_DQS_12)
LMS3_BB_ADC1_DB1_P: IC35.Y16(IO_L21P_T3_DQS_12)
LMS3_BB_ADC1_DB2_N: IC35.AA18(IO_L17N_T2_12)
LMS3_BB_ADC1_DB2_P: IC35.Y18(IO_L17P_T2_12)
LMS3_BB_ADC1_DB3_N: IC35.AE20(IO_L10N_T1_12)
LMS3_BB_ADC1_DB3_P: IC35.AD20(IO_L10P_T1_12)
LMS3_BB_ADC1_DB4_N: IC35.AE21(IO_L7N_T1_12)
LMS3_BB_ADC1_DB4_P: IC35.AD21(IO_L7P_T1_12)
LMS3_BB_ADC1_DB5_N: IC35.AF22(IO_L9N_T1_DQS_12)
LMS3_BB_ADC1_DB5_P: IC35.AE22(IO_L9P_T1_DQS_12)
LMS3_BB_ADC1_DB6_N: IC35.AF23(IO_L5N_T0_12)
LMS3_BB_ADC1_DB6_P: IC35.AE23(IO_L5P_T0_12)
LMS3_BB_ADC2_CLKOUT_N: IC35.V22(IO_L12N_T1_MRCC_13)
LMS3_BB_ADC2_CLKOUT_P: IC35.U22(IO_L12P_T1_MRCC_13)
LMS3_BB_ADC2_DA0_N: IC35.T15(IO_L20N_T3_13)
LMS3_BB_ADC2_DA0_P: IC35.T14(IO_L20P_T3_13)
LMS3_BB_ADC2_DA1_N: IC35.T18(IO_L21N_T3_DQS_13)
LMS3_BB_ADC2_DA1_P: IC35.T17(IO_L21P_T3_DQS_13)
LMS3_BB_ADC2_DA2_N: IC35.W23(IO_L10N_T1_13)
LMS3_BB_ADC2_DA2_P: IC35.V23(IO_L10P_T1_13)
LMS3_BB_ADC2_DA3_N: IC35.U19(IO_L17N_T2_13)
LMS3_BB_ADC2_DA3_P: IC35.T19(IO_L17P_T2_13)
LMS3_BB_ADC2_DA4_N: IC35.AA23(IO_L8N_T1_13)
LMS3_BB_ADC2_DA4_P: IC35.AA22(IO_L8P_T1_13)
LMS3_BB_ADC2_DA5_N: IC35.U26(IO_L1N_T0_13)
LMS3_BB_ADC2_DA5_P: IC35.U25(IO_L1P_T0_13)
LMS3_BB_ADC2_DA6_N: IC35.W26(IO_L2N_T0_13)
LMS3_BB_ADC2_DA6_P: IC35.V26(IO_L2P_T0_13)
LMS3_BB_ADC2_DB0_N: IC35.AC26(IO_L3N_T0_DQS_13)
LMS3_BB_ADC2_DB0_P: IC35.AB26(IO_L3P_T0_DQS_13)
LMS3_BB_ADC2_DB1_N: IC35.AB25(IO_L7N_T1_13)
LMS3_BB_ADC2_DB1_P: IC35.AA24(IO_L7P_T1_13)
LMS3_BB_ADC2_DB2_N: IC35.Y20(IO_L16N_T2_13)
LMS3_BB_ADC2_DB2_P: IC35.W20(IO_L16P_T2_13)
LMS3_BB_ADC2_DB3_N: IC35.AC24(IO_L9N_T1_DQS_13)
LMS3_BB_ADC2_DB3_P: IC35.AB24(IO_L9P_T1_DQS_13)
LMS3_BB_ADC2_DB4_N: IC35.W19(IO_L18N_T2_13)
LMS3_BB_ADC2_DB4_P: IC35.V19(IO_L18P_T2_13)
LMS3_BB_ADC2_DB5_N: IC35.AA25(IO_L5N_T0_13)
LMS3_BB_ADC2_DB5_P: IC35.Y25(IO_L5P_T0_13)
LMS3_BB_ADC2_DB6_N: IC35.Y26(IO_L4N_T0_13)
LMS3_BB_ADC2_DB6_P: IC35.W25(IO_L4P_T0_13)
PCIE_PERSTn: IC35.R23(IO_L24N_T3_A00_D16_14)
PCIE_SMCLK: IC35.R22(IO_L23N_T3_A02_D18_14)
PCIE_SMDAT: IC35.T23(IO_L24P_T3_A01_D17_14)
PCIE_WAKEn: IC35.R18(IO_25_14)
PD_LMS2_BB_ADC1_DRV: IC35.W14(IO_L24P_T3_12)
PD_LMS2_BB_ADC2_DRV: IC35.W15(IO_L24N_T3_12)
PD_LMS3_BB_ADC1_DRV: IC35.W16(IO_25_12)
PD_LMS3_BB_ADC2_DRV: IC35.AD18(IO_L15N_T2_DQS_12)
PMOD_A_PIN1: IC35.R25(IO_L19P_T3_A10_D26_14)
PMOD_A_PIN2: IC35.P23(IO_L17P_T2_A14_D30_14)
PMOD_A_PIN3: IC35.P21(IO_L14N_T2_SRCC_14)
PMOD_A_PIN4: IC35.P19(IO_L16P_T2_CSI_B_14)
PMOD_A_PIN7: IC35.R20(IO_L18P_T2_A12_D28_14)
PMOD_A_PIN8: IC35.R21(IO_L18N_T2_A11_D27_14)
PMOD_A_PIN9: IC35.P15(IO_L3P_T0_DQS_PUDC_B_14)
PMOD_A_PIN10: IC35.P16(IO_L3N_T0_DQS_EMCCLK_14)
PMOD_B_PIN1: IC35.L23(IO_L11N_T1_SRCC_14)
PMOD_B_PIN2: IC35.M24(IO_L10P_T1_D14_14)
PMOD_B_PIN3: IC35.M22(IO_L12N_T1_MRCC_14)
PMOD_B_PIN4: IC35.N22(IO_L13N_T2_MRCC_14)
PMOD_B_PIN7: IC35.N19(IO_L16N_T2_A15_D31_14)
PMOD_B_PIN8: IC35.P24(IO_L17N_T2_A13_D29_14)
PMOD_B_PIN9: IC35.P25(IO_L19N_T3_A09_D25_VREF_14)
PMOD_B_PIN10: IC35.N23(IO_L15P_T2_DQS_RDWR_B_14)
PTP_CLK1_OUT: IC35.T25(IO_L21N_T3_DQS_A06_D22_14)
PTP_CLK2_OUT: IC35.R26(IO_L22P_T3_A05_D21_14)
PTP_CLK3_OUT: IC35.P26(IO_L22N_T3_A04_D20_14)
RFSW_LMS2_RX2C_V1: IC35.J16(IO_L1N_T0_AD0N_15)
RFSW_LMS2_RX2IN_V1: IC35.M15(IO_L5P_T0_AD9P_15)
RFSW_LMS2_TRX1_V1: IC35.J14(IO_L2P_T0_AD8P_15)
RFSW_LMS2_TRX1T_V1: IC35.J15(IO_L2N_T0_AD8N_15)
RFSW_LMS2_TRX2T_V1: IC35.K18(IO_0_15)
WR_PTP_CLK0_20: IC35.AA19(IO_L13P_T2_MRCC_12)
WR_PTP_CLK1_20: IC35.L22(IO_L11P_T1_SRCC_14)
WR_PTP_CLK1_125_N: IC35.AC21(IO_L11N_T1_SRCC_12)
WR_PTP_CLK1_125_P: IC35.AB21(IO_L11P_T1_SRCC_12)
WR_PTP_SFP_LOS: IC35.T24(IO_L21P_T3_DQS_14)
WR_PTP_SFP_MOD_DEF0: IC35.K26(IO_L7N_T1_D10_14)
WR_PTP_SFP_MOD_DEF1: IC35.K25(IO_L7P_T1_D09_14)
WR_PTP_SFP_MOD_DEF2: IC35.N18(IO_L6N_T0_D08_VREF_14)
WR_PTP_SFP_RATE_SEL: IC35.M20(IO_L8P_T1_D11_14)
WR_PTP_SFP_TX_DISABLE: IC35.R17(IO_L5N_T0_D07_14)
WR_PTP_SFP_TX_FAULT: IC35.R16(IO_L5P_T0_D06_14)
XO_VC_FPGA: IC35.N26(IO_L20P_T3_A08_D24_14)

Not connected (* = marked no-connect by the designer): IC35 AB19(IO_L13N_T2_MRCC_12)* AC19(IO_L14P_T2_SRCC_12)* AD19(IO_L14N_T2_SRCC_12)* G20(IO_L11P_T1_SRCC_15)* G21(IO_L11N_T1_SRCC_15)* H22(IO_L13N_T2_MRCC_15)* M17(IO_L6N_T0_VREF_15)* U20(IO_L15N_T2_DQS_13)* V18(IO_L19P_T3_13)* Y15(IO_L23P_T3_12)* Y21(IO_L14N_T2_SRCC_13)*

### Notes on the sheet
- NF elements on sheet: -
- Number of NF elements on sheet: 0
- FPGA Banks 12, 13, 14, 15
- Board SPI interfaces:
  FPGA_SPI0 (VDIO_LMS (default 2.5V)): LMS1, LMS2, LMS3
  FPGA_SPI1 (2.5V): BB_ADC1, BB_ADC2, BB_ADC3, BB_ADC4, CDCM1, CDCM2
  FPGA_SPI2 (2.5V): XO_DAC, XO_20_DAC, LMS1_TX1DAC, LMS1_TX2DAC, ADF
- DO NOT MOVE!
- HW_VER2
- 2.5V
- HW_VER1
- MRCC
- 3.3V
- MRCC P
- SRCC P
- HW_VER0
- HW_VER3
- Project name:
- Title:
- Size:
- Date:
- A3
- Revision:
- Time:
- Sheet
- of
- File:
- (in symbol XC7A200T-2FBG676C, part A) BANK 12
- (in symbol XC7A200T-2FBG676C, part B) BANK 13
- (in symbol XC7A200T-2FBG676C, part C) BANK 14
- (in symbol XC7A200T-2FBG676C, part D) BANK 15

### Library data of the parts
IC35 = XC7A200T-2FBG676C: Artix-7 FPGA, 400 User I/Os, 8 GTP, 676-Ball BGA, Speed Grade 2, Commercial Grade, Pb-Free; Manufacturer: Xilinx; Part Description: IC FPGA 400 I/O 676FCBGA; Speed Grade: -2; Number of Logic Blocks (LABs): 16825; Number of Logic Elements/Cells: 215360; RAM Size: 13455360b; Number of I/Os: 400; Number of Registers: 269200; Memory Type: DDR3; Memory Size: 1GB; Max Supply Voltage: 1.05V; Min Supply Voltage: 950mV; ComponentLink1Description: Manufacturer URL; ComponentLink1URL: http://www.xilinx.com/; ComponentLink2Description: Datasheet; ComponentLink2URL: http://www.xilinx.com/support/documentation/data_sheets/ds180_7Series_Overview.pdf; ComponentLink3Description: Package Specification; ComponentLink3URL: http://www.xilinx.com/support/documentation/user_guides/ug475_7Series_Pkg_Pinout.pdf; ComponentLink4Description: DC and Switching Characteristics; ComponentLink4URL: http://www.xilinx.com/support/documentation/data_sheets/ds181_Artix_7_Data_Sheet.pdf; ComponentLink5Description: Package File; ComponentLink5URL: http://www.xilinx.com/support/packagefiles/a7packages/xc7a200tfbg676pkg.txt; ComponentLink6Description: Packaging and Pinout; ComponentLink6URL: http://www.xilinx.com/support/documentation/user_guides/ug475_7Series_Pkg_Pinout.pdf; Supplier 1: Digi-Key; Supplier Part Number 1: 122-1865-ND; Manufacturer Part Number 1: XC7A200T-2FBG676C; Stock 1: 124; Pricing 1: 1=261,30000 (USD); RoHS: Yes; Case/Package: FCBGA; Number of Pins: 676; Contact Plating: Copper,Tin,Silver; Min Operating Temperature: 0°C; Max Operating Temperature: 85°C; ComponentLink7URL: https://datasheet.ciiva.com/15066/ds181-artix-7-data-sheet-15066344.pdf?src-supplier=Digi-Key; ComponentLink7Description: https://datasheet.ciiva.com/15066/ds181-artix-7-data-sheet-15066344.pdf?src-supplier=Digi-Key; ComponentLink8URL: https://datasheet.ciiva.com/48475/ds180-7series-overview-48475947.pdf?src-supplier=Avnet; ComponentLink8Description: https://datasheet.ciiva.com/48475/ds180-7series-overview-48475947.pdf?src-supplier=Avnet

## Sheet 18_FPGA_B16_B33_B34_B35.SchDoc: FPGA Banks 16, 33, 34, 35
size A3; Organization: Lime Microsystems; Address1: Surrey Tech Centre; Address2: Guildford GU2 7YG; Address3: Surrey; Address4: United Kingdom; Revision: v1.0; SheetNumber: 18; SheetTotal: 31
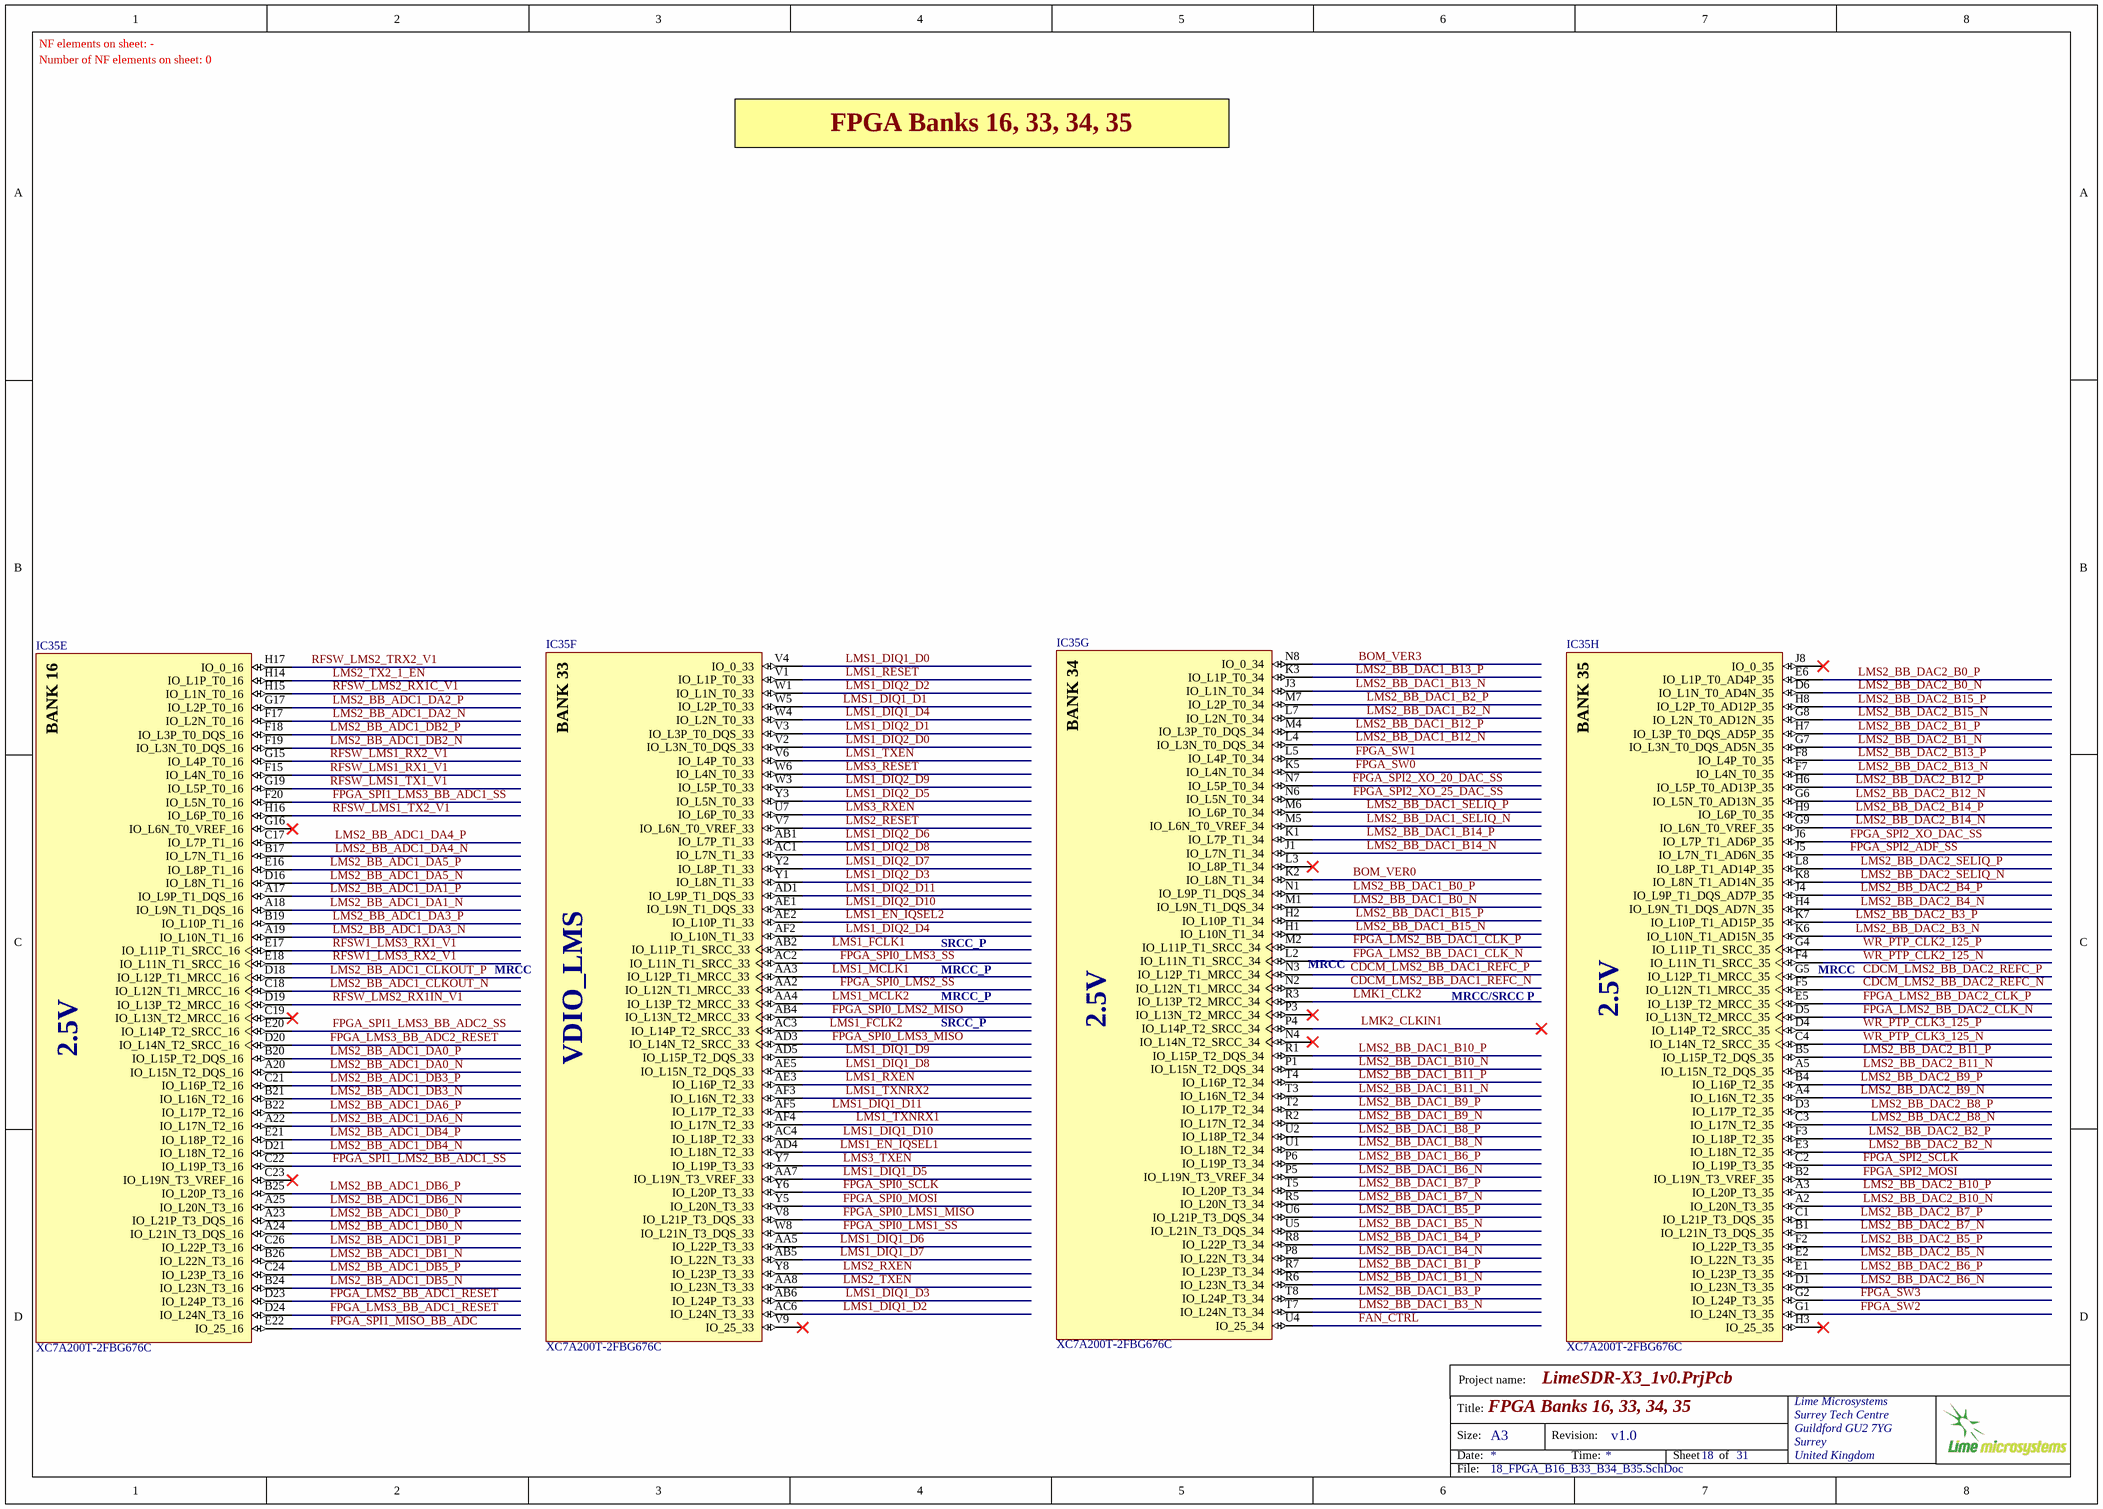
[diagram p17: 18_FPGA_B16_B33_B34_B35.SchDoc]

### Parts
IC35  XC7A200T-2FBG676C  [XC7A200T-2FBG676C_FBG676]  (parts E,F,G,H of 14)

### Nets
BOM_VER0: IC35.K2(IO_L8N_T1_34)
BOM_VER3: IC35.N8(IO_0_34)
CDCM_LMS2_BB_DAC1_REFC_N: IC35.N2(IO_L12N_T1_MRCC_34)
CDCM_LMS2_BB_DAC1_REFC_P: IC35.N3(IO_L12P_T1_MRCC_34)
CDCM_LMS2_BB_DAC2_REFC_N: IC35.F5(IO_L12N_T1_MRCC_35)
CDCM_LMS2_BB_DAC2_REFC_P: IC35.G5(IO_L12P_T1_MRCC_35)
FAN_CTRL: IC35.U4(IO_25_34)
FPGA_LMS2_BB_ADC1_RESET: IC35.D23(IO_L24P_T3_16)
FPGA_LMS2_BB_DAC1_CLK_N: IC35.L2(IO_L11N_T1_SRCC_34)
FPGA_LMS2_BB_DAC1_CLK_P: IC35.M2(IO_L11P_T1_SRCC_34)
FPGA_LMS2_BB_DAC2_CLK_N: IC35.D5(IO_L13N_T2_MRCC_35)
FPGA_LMS2_BB_DAC2_CLK_P: IC35.E5(IO_L13P_T2_MRCC_35)
FPGA_LMS3_BB_ADC1_RESET: IC35.D24(IO_L24N_T3_16)
FPGA_LMS3_BB_ADC2_RESET: IC35.D20(IO_L14N_T2_SRCC_16)
FPGA_SPI0_LMS1_MISO: IC35.V8(IO_L21P_T3_DQS_33)
FPGA_SPI0_LMS1_SS: IC35.W8(IO_L21N_T3_DQS_33)
FPGA_SPI0_LMS2_MISO: IC35.AB4(IO_L13N_T2_MRCC_33)
FPGA_SPI0_LMS2_SS: IC35.AA2(IO_L12N_T1_MRCC_33)
FPGA_SPI0_LMS3_MISO: IC35.AD3(IO_L14N_T2_SRCC_33)
FPGA_SPI0_LMS3_SS: IC35.AC2(IO_L11N_T1_SRCC_33)
FPGA_SPI0_MOSI: IC35.Y5(IO_L20N_T3_33)
FPGA_SPI0_SCLK: IC35.Y6(IO_L20P_T3_33)
FPGA_SPI1_LMS2_BB_ADC1_SS: IC35.C22(IO_L19P_T3_16)
FPGA_SPI1_LMS3_BB_ADC1_SS: IC35.F20(IO_L5N_T0_16)
FPGA_SPI1_LMS3_BB_ADC2_SS: IC35.E20(IO_L14P_T2_SRCC_16)
FPGA_SPI1_MISO_BB_ADC: IC35.E22(IO_25_16)
FPGA_SPI2_ADF_SS: IC35.J5(IO_L7N_T1_AD6N_35)
FPGA_SPI2_MOSI: IC35.B2(IO_L19N_T3_VREF_35)
FPGA_SPI2_SCLK: IC35.C2(IO_L19P_T3_35)
FPGA_SPI2_XO_20_DAC_SS: IC35.N7(IO_L5P_T0_34)
FPGA_SPI2_XO_25_DAC_SS: IC35.N6(IO_L5N_T0_34)
FPGA_SPI2_XO_DAC_SS: IC35.J6(IO_L7P_T1_AD6P_35)
FPGA_SW0: IC35.K5(IO_L4N_T0_34)
FPGA_SW1: IC35.L5(IO_L4P_T0_34)
FPGA_SW2: IC35.G1(IO_L24N_T3_35)
FPGA_SW3: IC35.G2(IO_L24P_T3_35)
LMK1_CLK2: IC35.R3(IO_L13P_T2_MRCC_34)
LMK2_CLKIN1: IC35.P4(IO_L14P_T2_SRCC_34)
LMS1_DIQ1_D0: IC35.V4(IO_0_33)
LMS1_DIQ1_D1: IC35.W5(IO_L2P_T0_33)
LMS1_DIQ1_D2: IC35.AC6(IO_L24N_T3_33)
LMS1_DIQ1_D3: IC35.AB6(IO_L24P_T3_33)
LMS1_DIQ1_D4: IC35.W4(IO_L2N_T0_33)
LMS1_DIQ1_D5: IC35.AA7(IO_L19N_T3_VREF_33)
LMS1_DIQ1_D6: IC35.AA5(IO_L22P_T3_33)
LMS1_DIQ1_D7: IC35.AB5(IO_L22N_T3_33)
LMS1_DIQ1_D8: IC35.AE5(IO_L15N_T2_DQS_33)
LMS1_DIQ1_D9: IC35.AD5(IO_L15P_T2_DQS_33)
LMS1_DIQ1_D10: IC35.AC4(IO_L18P_T2_33)
LMS1_DIQ1_D11: IC35.AF5(IO_L17P_T2_33)
LMS1_DIQ2_D0: IC35.V2(IO_L3N_T0_DQS_33)
LMS1_DIQ2_D1: IC35.V3(IO_L3P_T0_DQS_33)
LMS1_DIQ2_D2: IC35.W1(IO_L1N_T0_33)
LMS1_DIQ2_D3: IC35.Y1(IO_L8N_T1_33)
LMS1_DIQ2_D4: IC35.AF2(IO_L10N_T1_33)
LMS1_DIQ2_D5: IC35.Y3(IO_L5N_T0_33)
LMS1_DIQ2_D6: IC35.AB1(IO_L7P_T1_33)
LMS1_DIQ2_D7: IC35.Y2(IO_L8P_T1_33)
LMS1_DIQ2_D8: IC35.AC1(IO_L7N_T1_33)
LMS1_DIQ2_D9: IC35.W3(IO_L5P_T0_33)
LMS1_DIQ2_D10: IC35.AE1(IO_L9N_T1_DQS_33)
LMS1_DIQ2_D11: IC35.AD1(IO_L9P_T1_DQS_33)
LMS1_EN_IQSEL1: IC35.AD4(IO_L18N_T2_33)
LMS1_EN_IQSEL2: IC35.AE2(IO_L10P_T1_33)
LMS1_FCLK1: IC35.AB2(IO_L11P_T1_SRCC_33)
LMS1_FCLK2: IC35.AC3(IO_L14P_T2_SRCC_33)
LMS1_MCLK1: IC35.AA3(IO_L12P_T1_MRCC_33)
LMS1_MCLK2: IC35.AA4(IO_L13P_T2_MRCC_33)
LMS1_RESET: IC35.V1(IO_L1P_T0_33)
LMS1_RXEN: IC35.AE3(IO_L16P_T2_33)
LMS1_TXEN: IC35.V6(IO_L4P_T0_33)
LMS1_TXNRX1: IC35.AF4(IO_L17N_T2_33)
LMS1_TXNRX2: IC35.AF3(IO_L16N_T2_33)
LMS2_BB_ADC1_CLKOUT_N: IC35.C18(IO_L12N_T1_MRCC_16)
LMS2_BB_ADC1_CLKOUT_P: IC35.D18(IO_L12P_T1_MRCC_16)
LMS2_BB_ADC1_DA0_N: IC35.A20(IO_L15N_T2_DQS_16)
LMS2_BB_ADC1_DA0_P: IC35.B20(IO_L15P_T2_DQS_16)
LMS2_BB_ADC1_DA1_N: IC35.A18(IO_L9N_T1_DQS_16)
LMS2_BB_ADC1_DA1_P: IC35.A17(IO_L9P_T1_DQS_16)
LMS2_BB_ADC1_DA2_N: IC35.F17(IO_L2N_T0_16)
LMS2_BB_ADC1_DA2_P: IC35.G17(IO_L2P_T0_16)
LMS2_BB_ADC1_DA3_N: IC35.A19(IO_L10N_T1_16)
LMS2_BB_ADC1_DA3_P: IC35.B19(IO_L10P_T1_16)
LMS2_BB_ADC1_DA4_N: IC35.B17(IO_L7N_T1_16)
LMS2_BB_ADC1_DA4_P: IC35.C17(IO_L7P_T1_16)
LMS2_BB_ADC1_DA5_N: IC35.D16(IO_L8N_T1_16)
LMS2_BB_ADC1_DA5_P: IC35.E16(IO_L8P_T1_16)
LMS2_BB_ADC1_DA6_N: IC35.A22(IO_L17N_T2_16)
LMS2_BB_ADC1_DA6_P: IC35.B22(IO_L17P_T2_16)
LMS2_BB_ADC1_DB0_N: IC35.A24(IO_L21N_T3_DQS_16)
LMS2_BB_ADC1_DB0_P: IC35.A23(IO_L21P_T3_DQS_16)
LMS2_BB_ADC1_DB1_N: IC35.B26(IO_L22N_T3_16)
LMS2_BB_ADC1_DB1_P: IC35.C26(IO_L22P_T3_16)
LMS2_BB_ADC1_DB2_N: IC35.F19(IO_L3N_T0_DQS_16)
LMS2_BB_ADC1_DB2_P: IC35.F18(IO_L3P_T0_DQS_16)
LMS2_BB_ADC1_DB3_N: IC35.B21(IO_L16N_T2_16)
LMS2_BB_ADC1_DB3_P: IC35.C21(IO_L16P_T2_16)
LMS2_BB_ADC1_DB4_N: IC35.D21(IO_L18N_T2_16)
LMS2_BB_ADC1_DB4_P: IC35.E21(IO_L18P_T2_16)
LMS2_BB_ADC1_DB5_N: IC35.B24(IO_L23N_T3_16)
LMS2_BB_ADC1_DB5_P: IC35.C24(IO_L23P_T3_16)
LMS2_BB_ADC1_DB6_N: IC35.A25(IO_L20N_T3_16)
LMS2_BB_ADC1_DB6_P: IC35.B25(IO_L20P_T3_16)
LMS2_BB_DAC1_B0_N: IC35.M1(IO_L9N_T1_DQS_34)
LMS2_BB_DAC1_B0_P: IC35.N1(IO_L9P_T1_DQS_34)
LMS2_BB_DAC1_B1_N: IC35.R6(IO_L23N_T3_34)
LMS2_BB_DAC1_B1_P: IC35.R7(IO_L23P_T3_34)
LMS2_BB_DAC1_B2_N: IC35.L7(IO_L2N_T0_34)
LMS2_BB_DAC1_B2_P: IC35.M7(IO_L2P_T0_34)
LMS2_BB_DAC1_B3_N: IC35.T7(IO_L24N_T3_34)
LMS2_BB_DAC1_B3_P: IC35.T8(IO_L24P_T3_34)
LMS2_BB_DAC1_B4_N: IC35.P8(IO_L22N_T3_34)
LMS2_BB_DAC1_B4_P: IC35.R8(IO_L22P_T3_34)
LMS2_BB_DAC1_B5_N: IC35.U5(IO_L21N_T3_DQS_34)
LMS2_BB_DAC1_B5_P: IC35.U6(IO_L21P_T3_DQS_34)
LMS2_BB_DAC1_B6_N: IC35.P5(IO_L19N_T3_VREF_34)
LMS2_BB_DAC1_B6_P: IC35.P6(IO_L19P_T3_34)
LMS2_BB_DAC1_B7_N: IC35.R5(IO_L20N_T3_34)
LMS2_BB_DAC1_B7_P: IC35.T5(IO_L20P_T3_34)
LMS2_BB_DAC1_B8_N: IC35.U1(IO_L18N_T2_34)
LMS2_BB_DAC1_B8_P: IC35.U2(IO_L18P_T2_34)
LMS2_BB_DAC1_B9_N: IC35.R2(IO_L17N_T2_34)
LMS2_BB_DAC1_B9_P: IC35.T2(IO_L17P_T2_34)
LMS2_BB_DAC1_B10_N: IC35.P1(IO_L15N_T2_DQS_34)
LMS2_BB_DAC1_B10_P: IC35.R1(IO_L15P_T2_DQS_34)
LMS2_BB_DAC1_B11_N: IC35.T3(IO_L16N_T2_34)
LMS2_BB_DAC1_B11_P: IC35.T4(IO_L16P_T2_34)
LMS2_BB_DAC1_B12_N: IC35.L4(IO_L3N_T0_DQS_34)
LMS2_BB_DAC1_B12_P: IC35.M4(IO_L3P_T0_DQS_34)
LMS2_BB_DAC1_B13_N: IC35.J3(IO_L1N_T0_34)
LMS2_BB_DAC1_B13_P: IC35.K3(IO_L1P_T0_34)
LMS2_BB_DAC1_B14_N: IC35.J1(IO_L7N_T1_34)
LMS2_BB_DAC1_B14_P: IC35.K1(IO_L7P_T1_34)
LMS2_BB_DAC1_B15_N: IC35.H1(IO_L10N_T1_34)
LMS2_BB_DAC1_B15_P: IC35.H2(IO_L10P_T1_34)
LMS2_BB_DAC1_SELIQ_N: IC35.M5(IO_L6N_T0_VREF_34)
LMS2_BB_DAC1_SELIQ_P: IC35.M6(IO_L6P_T0_34)
LMS2_BB_DAC2_B0_N: IC35.D6(IO_L1N_T0_AD4N_35)
LMS2_BB_DAC2_B0_P: IC35.E6(IO_L1P_T0_AD4P_35)
LMS2_BB_DAC2_B1_N: IC35.G7(IO_L3N_T0_DQS_AD5N_35)
LMS2_BB_DAC2_B1_P: IC35.H7(IO_L3P_T0_DQS_AD5P_35)
LMS2_BB_DAC2_B2_N: IC35.E3(IO_L18N_T2_35)
LMS2_BB_DAC2_B2_P: IC35.F3(IO_L18P_T2_35)
LMS2_BB_DAC2_B3_N: IC35.K6(IO_L10N_T1_AD15N_35)
LMS2_BB_DAC2_B3_P: IC35.K7(IO_L10P_T1_AD15P_35)
LMS2_BB_DAC2_B4_N: IC35.H4(IO_L9N_T1_DQS_AD7N_35)
LMS2_BB_DAC2_B4_P: IC35.J4(IO_L9P_T1_DQS_AD7P_35)
LMS2_BB_DAC2_B5_N: IC35.E2(IO_L22N_T3_35)
LMS2_BB_DAC2_B5_P: IC35.F2(IO_L22P_T3_35)
LMS2_BB_DAC2_B6_N: IC35.D1(IO_L23N_T3_35)
LMS2_BB_DAC2_B6_P: IC35.E1(IO_L23P_T3_35)
LMS2_BB_DAC2_B7_N: IC35.B1(IO_L21N_T3_DQS_35)
LMS2_BB_DAC2_B7_P: IC35.C1(IO_L21P_T3_DQS_35)
LMS2_BB_DAC2_B8_N: IC35.C3(IO_L17N_T2_35)
LMS2_BB_DAC2_B8_P: IC35.D3(IO_L17P_T2_35)
LMS2_BB_DAC2_B9_N: IC35.A4(IO_L16N_T2_35)
LMS2_BB_DAC2_B9_P: IC35.B4(IO_L16P_T2_35)
LMS2_BB_DAC2_B10_N: IC35.A2(IO_L20N_T3_35)
LMS2_BB_DAC2_B10_P: IC35.A3(IO_L20P_T3_35)
LMS2_BB_DAC2_B11_N: IC35.A5(IO_L15N_T2_DQS_35)
LMS2_BB_DAC2_B11_P: IC35.B5(IO_L15P_T2_DQS_35)
LMS2_BB_DAC2_B12_N: IC35.G6(IO_L5N_T0_AD13N_35)
LMS2_BB_DAC2_B12_P: IC35.H6(IO_L5P_T0_AD13P_35)
LMS2_BB_DAC2_B13_N: IC35.F7(IO_L4N_T0_35)
LMS2_BB_DAC2_B13_P: IC35.F8(IO_L4P_T0_35)
LMS2_BB_DAC2_B14_N: IC35.G9(IO_L6N_T0_VREF_35)
LMS2_BB_DAC2_B14_P: IC35.H9(IO_L6P_T0_35)
LMS2_BB_DAC2_B15_N: IC35.G8(IO_L2N_T0_AD12N_35)
LMS2_BB_DAC2_B15_P: IC35.H8(IO_L2P_T0_AD12P_35)
LMS2_BB_DAC2_SELIQ_N: IC35.K8(IO_L8N_T1_AD14N_35)
LMS2_BB_DAC2_SELIQ_P: IC35.L8(IO_L8P_T1_AD14P_35)
LMS2_RESET: IC35.V7(IO_L6N_T0_VREF_33)
LMS2_RXEN: IC35.Y8(IO_L23P_T3_33)
LMS2_TX2_1_EN: IC35.H14(IO_L1P_T0_16)
LMS2_TXEN: IC35.AA8(IO_L23N_T3_33)
LMS3_RESET: IC35.W6(IO_L4N_T0_33)
LMS3_RXEN: IC35.U7(IO_L6P_T0_33)
LMS3_TXEN: IC35.Y7(IO_L19P_T3_33)
RFSW1_LMS3_RX1_V1: IC35.E17(IO_L11P_T1_SRCC_16)
RFSW1_LMS3_RX2_V1: IC35.E18(IO_L11N_T1_SRCC_16)
RFSW_LMS1_RX1_V1: IC35.F15(IO_L4N_T0_16)
RFSW_LMS1_RX2_V1: IC35.G15(IO_L4P_T0_16)
RFSW_LMS1_TX1_V1: IC35.G19(IO_L5P_T0_16)
RFSW_LMS1_TX2_V1: IC35.H16(IO_L6P_T0_16)
RFSW_LMS2_RX1C_V1: IC35.H15(IO_L1N_T0_16)
RFSW_LMS2_RX1IN_V1: IC35.D19(IO_L13P_T2_MRCC_16)
RFSW_LMS2_TRX2_V1: IC35.H17(IO_0_16)
WR_PTP_CLK2_125_N: IC35.F4(IO_L11N_T1_SRCC_35)
WR_PTP_CLK2_125_P: IC35.G4(IO_L11P_T1_SRCC_35)
WR_PTP_CLK3_125_N: IC35.C4(IO_L14N_T2_SRCC_35)
WR_PTP_CLK3_125_P: IC35.D4(IO_L14P_T2_SRCC_35)

Not connected (* = marked no-connect by the designer): IC35 C19(IO_L13N_T2_MRCC_16)* C23(IO_L19N_T3_VREF_16)* G16(IO_L6N_T0_VREF_16)* H3(IO_25_35)* J8(IO_0_35)* L3(IO_L8P_T1_34)* N4(IO_L14N_T2_SRCC_34)* P3(IO_L13N_T2_MRCC_34)* V9(IO_25_33)*

### Notes on the sheet
- NF elements on sheet: -
- Number of NF elements on sheet: 0
- FPGA Banks 16, 33, 34, 35
- MRCC
- MRCC_P
- SRCC_P
- (near IC35) MRCC
- 2.5V
- MRCC/SRCC P
- VDIO_LMS
- Project name:
- Title:
- Size:
- Date:
- A3
- Revision:
- Time:
- Sheet
- of
- File:
- (in symbol XC7A200T-2FBG676C, part E) BANK 16
- (in symbol XC7A200T-2FBG676C, part F) BANK 33
- (in symbol XC7A200T-2FBG676C, part G) BANK 34
- (in symbol XC7A200T-2FBG676C, part H) BANK 35

### Library data of the parts
IC35 = XC7A200T-2FBG676C: as IC35 on sheet 17_FPGA_B12_B13_B14_B15; ComponentLink1Description: Manufacturer URL; ComponentLink1URL: http://www.xilinx.com/; ComponentLink2Description: Datasheet; ComponentLink2URL: http://www.xilinx.com/support/documentation/data_sheets/ds180_7Series_Overview.pdf; ComponentLink3Description: Package Specification; ComponentLink3URL: http://www.xilinx.com/support/documentation/user_guides/ug475_7Series_Pkg_Pinout.pdf; ComponentLink4Description: DC and Switching Characteristics; ComponentLink4URL: http://www.xilinx.com/support/documentation/data_sheets/ds181_Artix_7_Data_Sheet.pdf; ComponentLink5Description: Package File; ComponentLink5URL: http://www.xilinx.com/support/packagefiles/a7packages/xc7a200tfbg676pkg.txt; ComponentLink6Description: Packaging and Pinout; ComponentLink6URL: http://www.xilinx.com/support/documentation/user_guides/ug475_7Series_Pkg_Pinout.pdf; Supplier 1: Digi-Key; Supplier Part Number 1: 122-1865-ND; Manufacturer Part Number 1: XC7A200T-2FBG676C; Stock 1: 124; Pricing 1: 1=261,30000 (USD); RoHS: Yes; Case/Package: FCBGA; Number of Pins: 676; Contact Plating: Copper,Tin,Silver; Min Operating Temperature: 0°C; Max Operating Temperature: 85°C; ComponentLink7URL: https://datasheet.ciiva.com/15066/ds181-artix-7-data-sheet-15066344.pdf?src-supplier=Digi-Key; ComponentLink7Description: https://datasheet.ciiva.com/15066/ds181-artix-7-data-sheet-15066344.pdf?src-supplier=Digi-Key; ComponentLink8URL: https://datasheet.ciiva.com/48475/ds180-7series-overview-48475947.pdf?src-supplier=Avnet; ComponentLink8Description: https://datasheet.ciiva.com/48475/ds180-7series-overview-48475947.pdf?src-supplier=Avnet